# EAGLE design bioshield (EAGLE 7.5.0)

## Sheet 1 of 7: INTERFACE
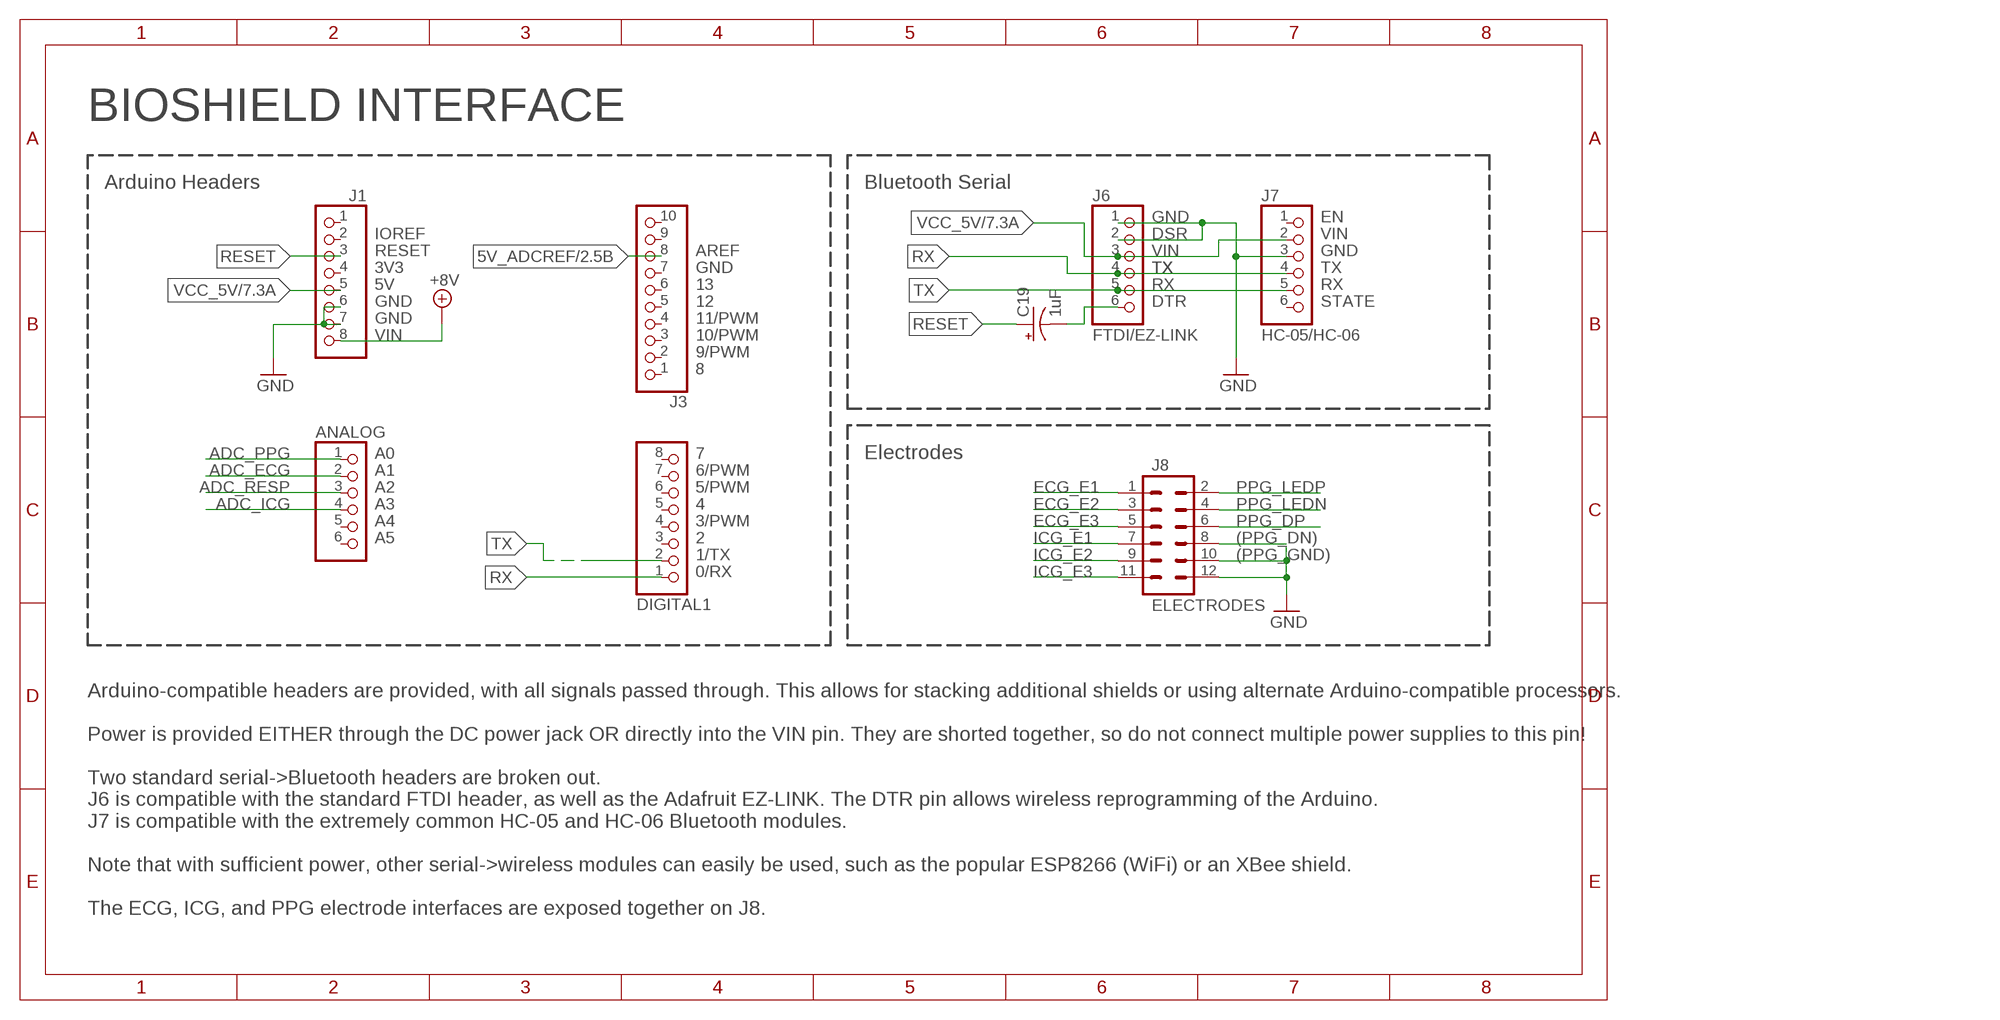
[diagram p0: schematic, sheet 1]

### Parts
ANALOG  PINHD-1X6  [1X06]
C19  1uF  CPOL-USE2-5  [E2-5]
DIGITAL1  PINHD-1X8TH  [1X08-TH]
J1  PINHD-1X8TH  [1X08-TH]
J3  PINHD-1X10TH  [1X10-TH]
J6  FTDI/EZ-LINK  PINHD-1X6  [1X06]
J7  HC-05/HC-06  PINHD-1X6  [1X06]
J8  ELECTRODES  M06X2PTH_FEMALE  [2X6]

### Nets
5V_ADCREF: J3.8 ; also sheet 2
+8V: J1.8 ; also sheet 2,3,4,5,6
ADC_ECG: ANALOG.2 ; also sheet 7
ADC_ICG: ANALOG.4 ; also sheet 7
ADC_PPG: ANALOG.1 ; also sheet 7
ADC_RESP: ANALOG.3 ; also sheet 7
ECG_E1: J8.1 ; also sheet 3
ECG_E2: J8.3 ; also sheet 3
ECG_E3: J8.5 ; also sheet 3
GND: J1.6 J1.7 J6.1 J6.2 J7.3 J8.8 J8.10 J8.12 ; also sheet 2,3,4,5,6,7
ICG_E1: J8.7 ; also sheet 4
ICG_E2: J8.9 ; also sheet 4
ICG_E3: J8.11 ; also sheet 4
N$6: C19.- J6.6
PPG_DP: J8.6 ; also sheet 6
PPG_LEDN: J8.4 ; also sheet 6
PPG_LEDP: J8.2 ; also sheet 6
RESET: C19.+ J1.3
RX: DIGITAL1.1 J6.4 J7.4
TX: DIGITAL1.2 J6.5 J7.5
VCC_5V: J1.5 J6.3 J7.2 ; also sheet 7
Unconnected: ANALOG.5 ANALOG.6 DIGITAL1.3 DIGITAL1.4 DIGITAL1.5 DIGITAL1.6 DIGITAL1.7 DIGITAL1.8 J1.1 J1.2 J1.4 J3.1 J3.2 J3.3 J3.4 J3.5 J3.6 J3.7 J3.9 J3.10 J7.1 J7.6

### Notes on the sheet
- BIOSHIELD INTERFACE
- Arduino Headers | Bluetooth Serial
- GND | EN
- IOREF | DSR | VIN
- RESET | AREF | VIN | GND
- 3V3 | GND | TX | TX | TX
- 5V | 13 | RX | RX
- GND | 12 | DTR | STATE
- GND | 11/PWM
- VIN | 10/PWM
- 9/PWM
- 8
- A0 | 7 | Electrodes
- A1 | 6/PWM
- A2 | 5/PWM
- A3 | 4
- A4 | 3/PWM
- A5 | 2 | (PPG_DN)
- 1/TX | (PPG_GND)
- 0/RX
- Arduino-compatible headers are provided, with all signals passed through. This allows for stacking additional shields or using alternate Arduino-compatible processors.
  
  Power is provided EITHER through the DC power jack OR directly into the VIN pin. They are shorted together, so do not connect multiple power supplies to this pin\!
  
  Two standard serial->Bluetooth headers are broken out. 
  J6 is compatible with the standard FTDI header, as well as the Adafruit EZ-LINK. The DTR pin allows wireless reprogramming of the Arduino.
  J7 is compatible with the extremely common HC-05 and HC-06 Bluetooth modules.
  
  Note that with sufficient power, other serial->wireless modules can easily be used, such as the popular ESP8266 (WiFi) or an XBee shield.
  
  The ECG, ICG, and PPG electrode interfaces are exposed together on J8.

## Sheet 2 of 7: POWER
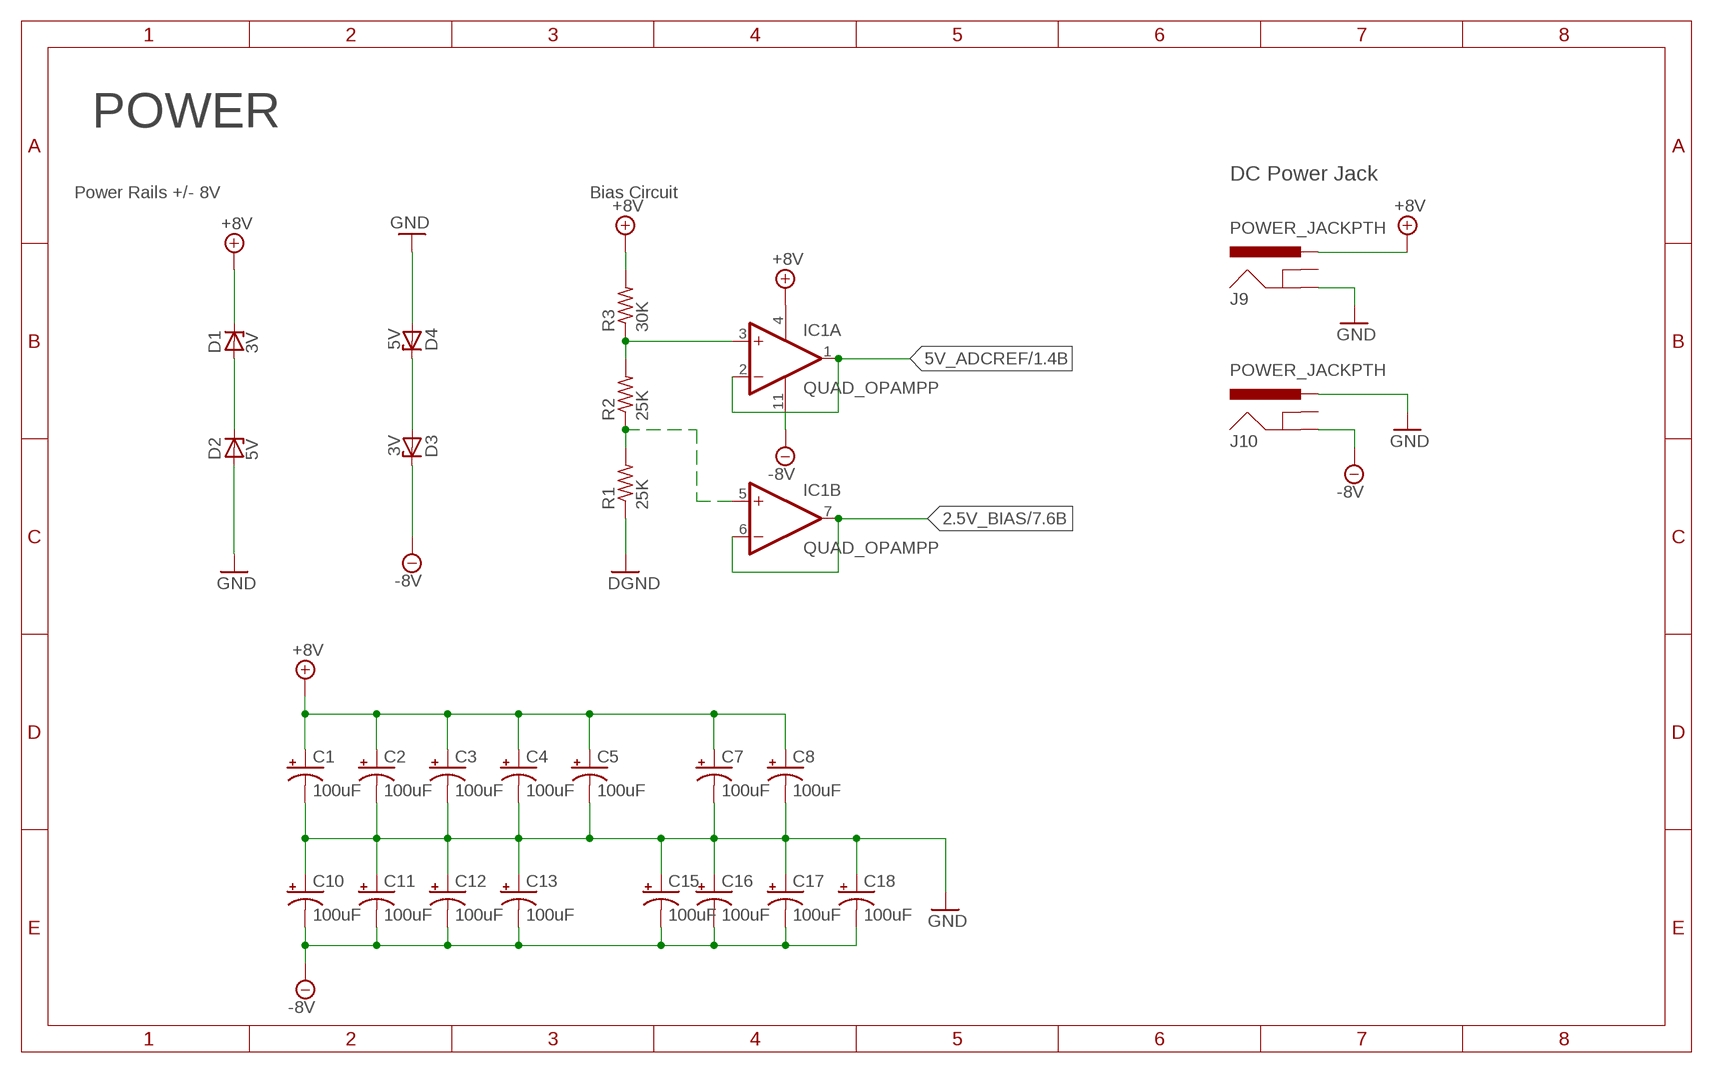
[diagram p1: schematic, sheet 2]

### Parts
C1  100uF  CAP_POLPTH1  [CPOL-RADIAL-100UF-25V]
C2  100uF  CAP_POLPTH1  [CPOL-RADIAL-100UF-25V]
C3  100uF  CAP_POLPTH1  [CPOL-RADIAL-100UF-25V]
C4  100uF  CAP_POLPTH1  [CPOL-RADIAL-100UF-25V]
C5  100uF  CAP_POLPTH1  [CPOL-RADIAL-100UF-25V]
C7  100uF  CAP_POLPTH1  [CPOL-RADIAL-100UF-25V]
C8  100uF  CAP_POLPTH1  [CPOL-RADIAL-100UF-25V]
C10  100uF  CAP_POLPTH1  [CPOL-RADIAL-100UF-25V]
C11  100uF  CAP_POLPTH1  [CPOL-RADIAL-100UF-25V]
C12  100uF  CAP_POLPTH1  [CPOL-RADIAL-100UF-25V]
C13  100uF  CAP_POLPTH1  [CPOL-RADIAL-100UF-25V]
C15  100uF  CAP_POLPTH1  [CPOL-RADIAL-100UF-25V]
C16  100uF  CAP_POLPTH1  [CPOL-RADIAL-100UF-25V]
C17  100uF  CAP_POLPTH1  [CPOL-RADIAL-100UF-25V]
C18  100uF  CAP_POLPTH1  [CPOL-RADIAL-100UF-25V]
D1  3V  ZENER-DIODEZD-10  [ZDIO-10]
D2  5V  ZENER-DIODEZD-10  [ZDIO-10]
D3  3V  ZENER-DIODEZD-10  [ZDIO-10]
D4  5V  ZENER-DIODEZD-10  [ZDIO-10]
IC1  QUAD_OPAMPP  [DIL14]
J9  POWER_JACKPTH  [POWER_JACK_PTH]
J10  POWER_JACKPTH  [POWER_JACK_PTH]
R1  25K  R-US_0207/10  [0207/10]
R2  25K  R-US_0207/10  [0207/10]
R3  30K  R-US_0207/10  [0207/10]

### Nets
2.5V_BIAS: IC1.6(B:-IN) IC1.7(B:OUT) ; also sheet 7
5V_ADCREF: IC1.1(A:OUT) IC1.2(A:-IN) ; also sheet 1
+8V: C1.1(+) C2.1(+) C3.1(+) C4.1(+) C5.1(+) C7.1(+) C8.1(+) D1.C IC1.4(P:V+) J9.PWR R3.2 ; also sheet 1,3,4,5,6
-8V: C10.2(-) C11.2(-) C12.2(-) C13.2(-) C15.2(-) C16.2(-) C17.2(-) C18.2(-) D3.C IC1.11(P:V-) J10.GND ; also sheet 3,4,5,6
GND: C1.2(-) C2.2(-) C3.2(-) C4.2(-) C5.2(-) C7.2(-) C8.2(-) C10.1(+) C11.1(+) C12.1(+) C13.1(+) C15.1(+) C16.1(+) C17.1(+) C18.1(+) D2.A D4.A J9.GND J10.PWR R1.1 ; supply symbol labelled DGND ; also sheet 1,3,4,5,6,7
N$3: IC1.5(B:+IN) R1.2 R2.1
N$10: D1.A D2.C
N$28: IC1.3(A:+IN) R2.2 R3.1
N$33: D3.A D4.C
Unconnected: J9.GNDBREAK J10.GNDBREAK

### Notes on the sheet
- POWER
- DC Power Jack
- Power Rails +/- 8V | Bias Circuit

## Sheet 3 of 7: ECG
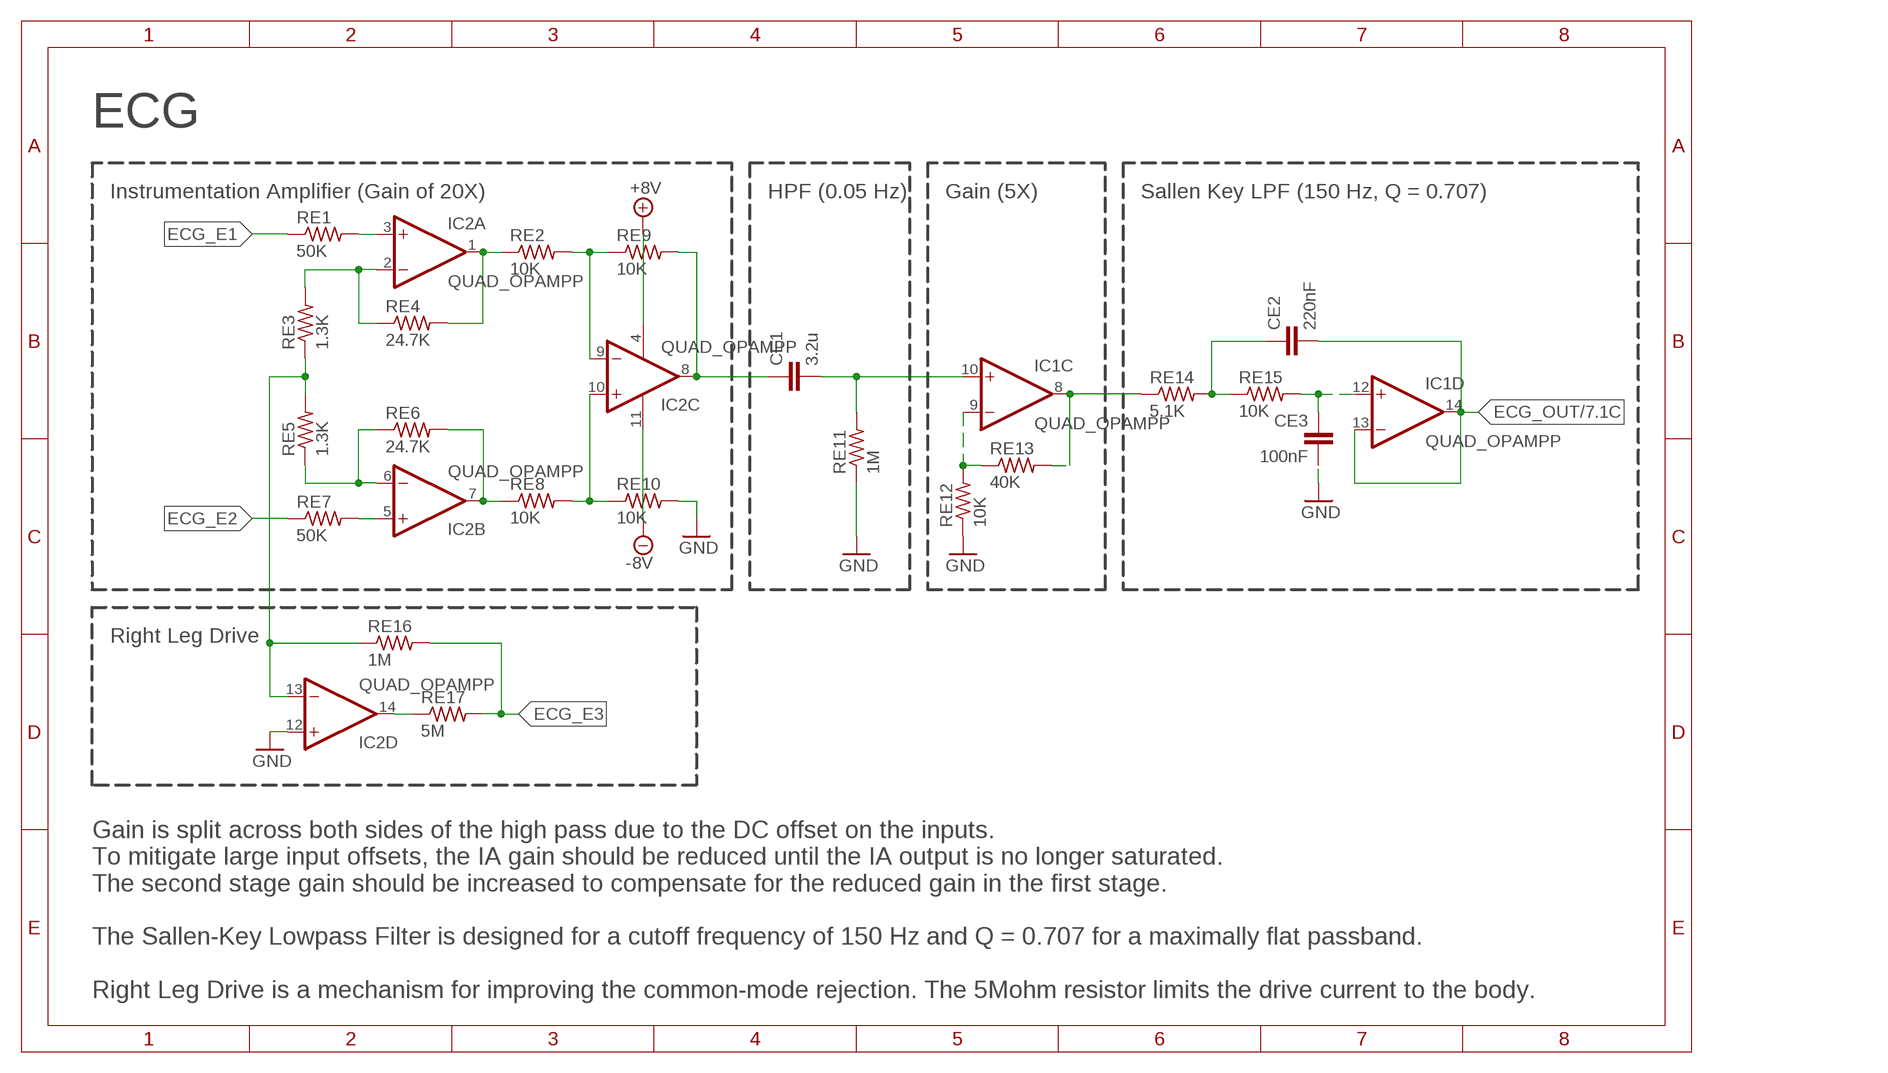
[diagram p2: schematic, sheet 3]

### Parts
CE1  3.2u  CAPPTH1  [CAP-PTH-5MM]
CE2  220nF  CAPPTH1  [CAP-PTH-5MM]
CE3  100nF  CAPPTH1  [CAP-PTH-5MM]
IC2  QUAD_OPAMPP  [DIL14]
RE1  50K  R-US_0207/10  [0207/10]
RE2  10K  R-US_0207/10  [0207/10]
RE3  1.3K  R-US_0207/10  [0207/10]
RE4  24.7K  R-US_0207/10  [0207/10]
RE5  1.3K  R-US_0207/10  [0207/10]
RE6  24.7K  R-US_0207/10  [0207/10]
RE7  50K  R-US_0207/10  [0207/10]
RE8  10K  R-US_0207/10  [0207/10]
RE9  10K  R-US_0207/10  [0207/10]
RE10  10K  R-US_0207/10  [0207/10]
RE11  1M  R-US_0207/10  [0207/10]
RE12  10K  R-US_0207/10  [0207/10]
RE13  40K  R-US_0207/10  [0207/10]
RE14  5.1K  R-US_0207/10  [0207/10]
RE15  10K  R-US_0207/10  [0207/10]
RE16  1M  R-US_0207/10  [0207/10]
RE17  5M  R-US_0207/10  [0207/10]

### Nets
+8V: IC2.4(P:V+) ; also sheet 1,2,4,5,6
-8V: IC2.11(P:V-) ; also sheet 2,4,5,6
ECG_E1: RE1.1 ; also sheet 1
ECG_E2: RE7.1 ; also sheet 1
ECG_E3: RE16.2 RE17.2 ; also sheet 1
ECG_OUT: CE2.2 IC1.13(D:-IN) IC1.14(D:OUT) ; also sheet 7
GND: CE3.2 IC2.12(D:+IN) RE10.2 RE11.1 RE12.1 ; also sheet 1,2,4,5,6,7
N$2: IC1.9(C:-IN) RE12.2 RE13.1
N$11: CE1.2 IC1.10(C:+IN) RE11.2
N$12: CE3.1 IC1.12(D:+IN) RE15.2
N$13: IC1.8(C:OUT) RE13.2 RE14.1
N$14: CE2.1 RE14.2 RE15.1
N$15: IC2.14(D:OUT) RE17.1
N$16: IC2.5(B:+IN) RE7.2
N$26: IC2.13(D:-IN) RE3.1 RE5.2 RE16.1
N$47: IC2.6(B:-IN) RE5.1 RE6.1
N$69: IC2.7(B:OUT) RE6.2 RE8.1
N$70: IC2.10(C:+IN) RE8.2 RE10.1
N$71: IC2.2(A:-IN) RE3.2 RE4.1
N$72: IC2.1(A:OUT) RE2.1 RE4.2
N$73: IC2.3(A:+IN) RE1.2
N$75: IC2.9(C:-IN) RE2.2 RE9.1
N$77: CE1.1 IC2.8(C:OUT) RE9.2

### Notes on the sheet
- ECG
- Instrumentation Amplifier (Gain of 20X) | HPF (0.05 Hz) | Gain (5X) | Sallen Key LPF (150 Hz, Q = 0.707)
- Right Leg Drive
- Gain is split across both sides of the high pass due to the DC offset on the inputs.
  To mitigate large input offsets, the IA gain should be reduced until the IA output is no longer saturated. 
  The second stage gain should be increased to compensate for the reduced gain in the first stage.
  
  The Sallen-Key Lowpass Filter is designed for a cutoff frequency of 150 Hz and Q = 0.707 for a maximally flat passband.
  
  Right Leg Drive is a mechanism for improving the common-mode rejection. The 5Mohm resistor limits the drive current to the body.

## Sheet 4 of 7: ICG
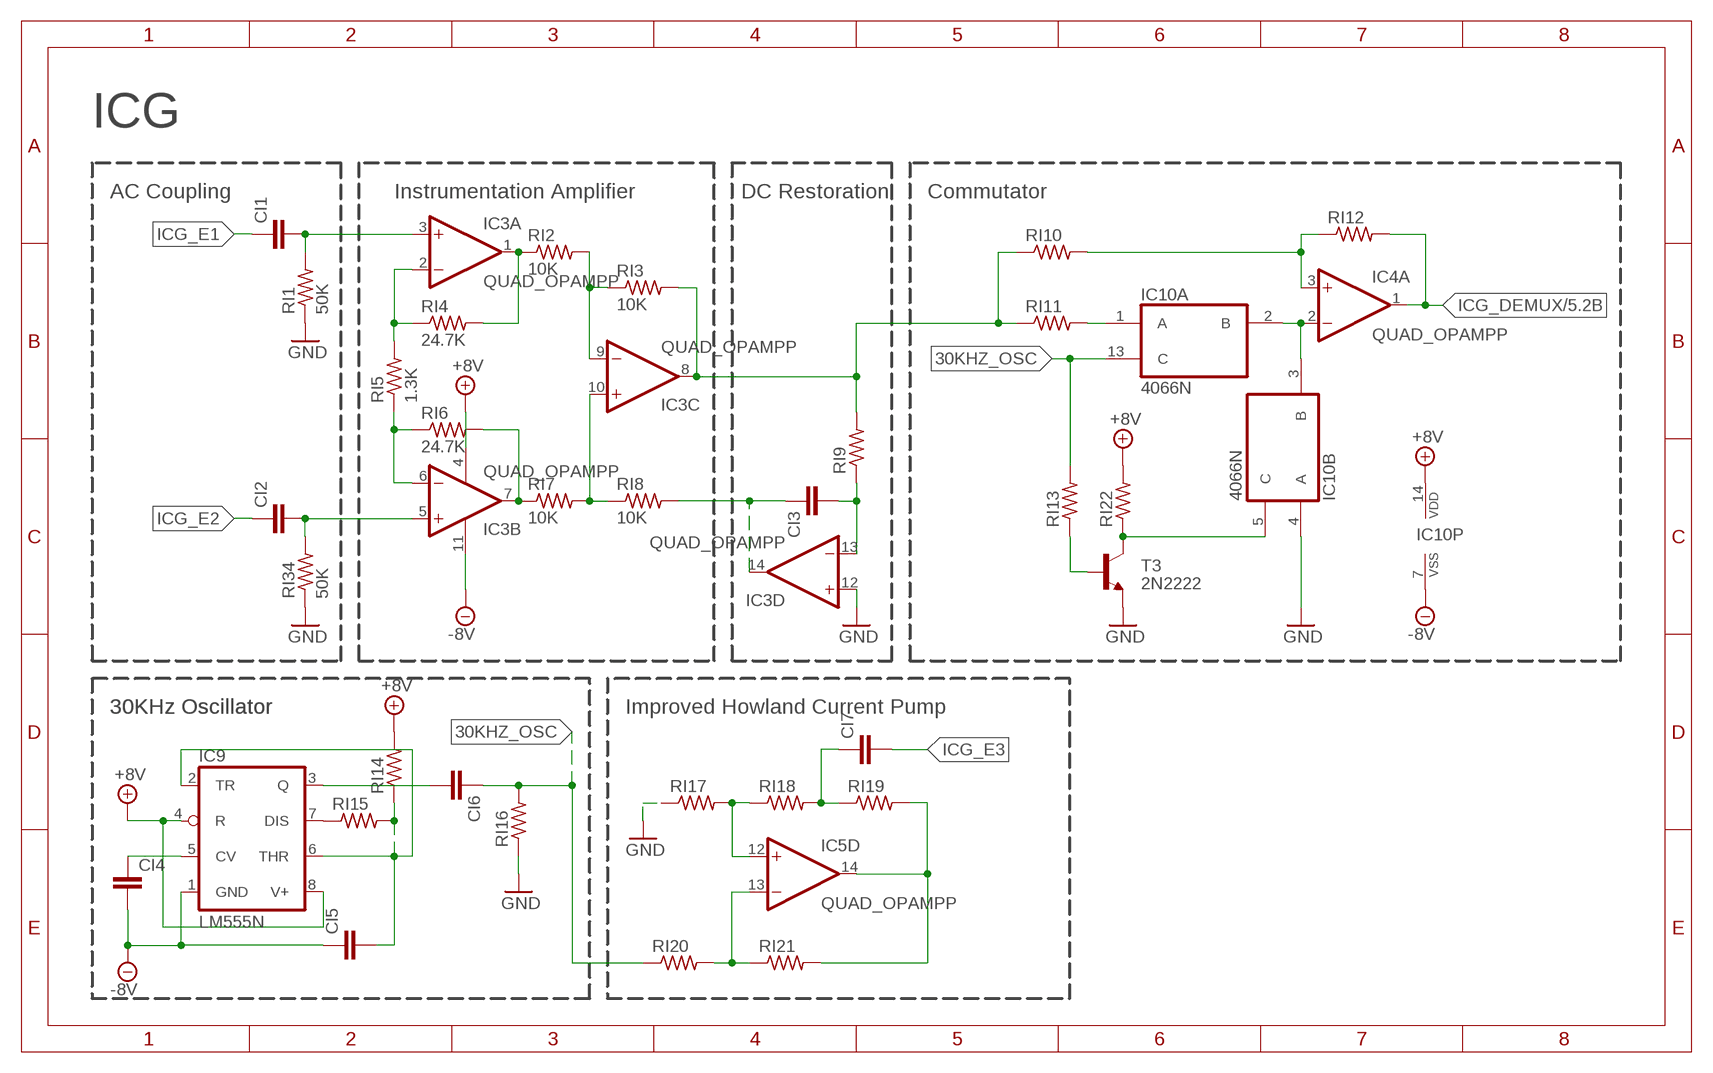
[diagram p3: schematic, sheet 4]

### Parts
CI1  CAPPTH1  [CAP-PTH-5MM]
CI2  CAPPTH1  [CAP-PTH-5MM]
CI3  CAPPTH1  [CAP-PTH-5MM]
CI4  CAPPTH1  [CAP-PTH-5MM]
CI5  CAPPTH1  [CAP-PTH-5MM]
CI6  CAPPTH1  [CAP-PTH-5MM]
CI7  CAPPTH1  [CAP-PTH-5MM]
IC3  QUAD_OPAMPP  [DIL14]
IC4  QUAD_OPAMPP  [DIL14]
IC5  QUAD_OPAMPP  [DIL14]
IC9  LM555N  [DIL08]
IC10  4066N  [DIL14]
RI1  50K  R-US_0207/10  [0207/10]
RI2  10K  R-US_0207/10  [0207/10]
RI3  10K  R-US_0207/10  [0207/10]
RI4  24.7K  R-US_0207/10  [0207/10]
RI5  1.3K  R-US_0207/10  [0207/10]
RI6  24.7K  R-US_0207/10  [0207/10]
RI7  10K  R-US_0207/10  [0207/10]
RI8  10K  R-US_0207/10  [0207/10]
RI9  R-US_0207/10  [0207/10]
RI10  R-US_0207/10  [0207/10]
RI11  R-US_0207/10  [0207/10]
RI12  R-US_0207/10  [0207/10]
RI13  R-US_0207/10  [0207/10]
RI14  R-US_0207/10  [0207/10]
RI15  R-US_0207/10  [0207/10]
RI16  R-US_0207/10  [0207/10]
RI17  R-US_0207/10  [0207/10]
RI18  R-US_0207/10  [0207/10]
RI19  R-US_0207/10  [0207/10]
RI20  R-US_0207/10  [0207/10]
RI21  R-US_0207/10  [0207/10]
RI22  R-US_0207/10  [0207/10]
RI34  50K  R-US_0207/10  [0207/10]
T3  2N2222  [TO92-EBC-OVAL]

### Nets
30KHZ_OSC: CI6.1 IC10.13(A:C) RI13.2 RI16.2 RI20.1
+8V: IC3.4(P:V+) IC9.4(R) IC9.8(V+) IC10.14(P:VDD) RI14.2 RI22.2 ; also sheet 1,2,3,5,6
-8V: CI4.2 CI5.1 IC3.11(P:V-) IC9.1(GND) IC10.7(P:VSS) ; also sheet 2,3,5,6
ELECTRODE3: CI7.1 RI18.2 RI19.1
GND: IC3.12(D:+IN) IC10.4(B:A) RI1.1 RI16.1 RI17.1 RI34.1 T3.E ; also sheet 1,2,3,5,6,7
ICG_DEMUX: IC4.1(A:OUT) RI12.2 ; also sheet 5
ICG_E1: CI1.1 ; also sheet 1
ICG_E2: CI2.1 ; also sheet 1
ICG_E3: CI7.2 ; also sheet 1
N$23: CI2.2 IC3.5(B:+IN) RI34.2
N$24: CI3.1 IC3.14(D:OUT) RI8.2
N$25: IC3.6(B:-IN) RI5.1 RI6.1
N$27: IC3.7(B:OUT) RI6.2 RI7.1
N$32: CI5.2 IC9.2(TR) IC9.6(THR) RI14.1 RI15.2
N$35: IC10.1(A:A) RI11.2
N$36: IC9.7(DIS) RI15.1
N$37: IC4.2(A:-IN) IC10.2(A:B) IC10.3(B:B)
N$51: RI13.1 T3.B
N$58: CI4.1 IC9.5(CV)
N$63: CI6.2 IC9.3(Q)
N$74: IC3.10(C:+IN) RI7.2 RI8.1
N$76: IC3.2(A:-IN) RI4.1 RI5.2
N$78: IC3.1(A:OUT) RI2.1 RI4.2
N$79: CI1.2 IC3.3(A:+IN) RI1.2
N$80: IC3.9(C:-IN) RI2.2 RI3.1
N$84: IC3.8(C:OUT) RI3.2 RI9.2 RI10.1 RI11.1
N$95: IC5.13(D:-IN) RI20.2 RI21.1
N$100: IC5.12(D:+IN) RI17.2 RI18.1
N$101: CI3.2 IC3.13(D:-IN) RI9.1
N$102: IC4.3(A:+IN) RI10.2 RI12.1
RI13: IC10.5(B:C) RI22.1 T3.C
V+: IC5.14(D:OUT) RI19.2 RI21.2

### Notes on the sheet
- ICG
- AC Coupling | Instrumentation Amplifier | DC Restoration | Commutator
- 30KHz Oscillator | 30KHz Oscillator | Improved Howland Current Pump

## Sheet 5 of 7: ICG con't
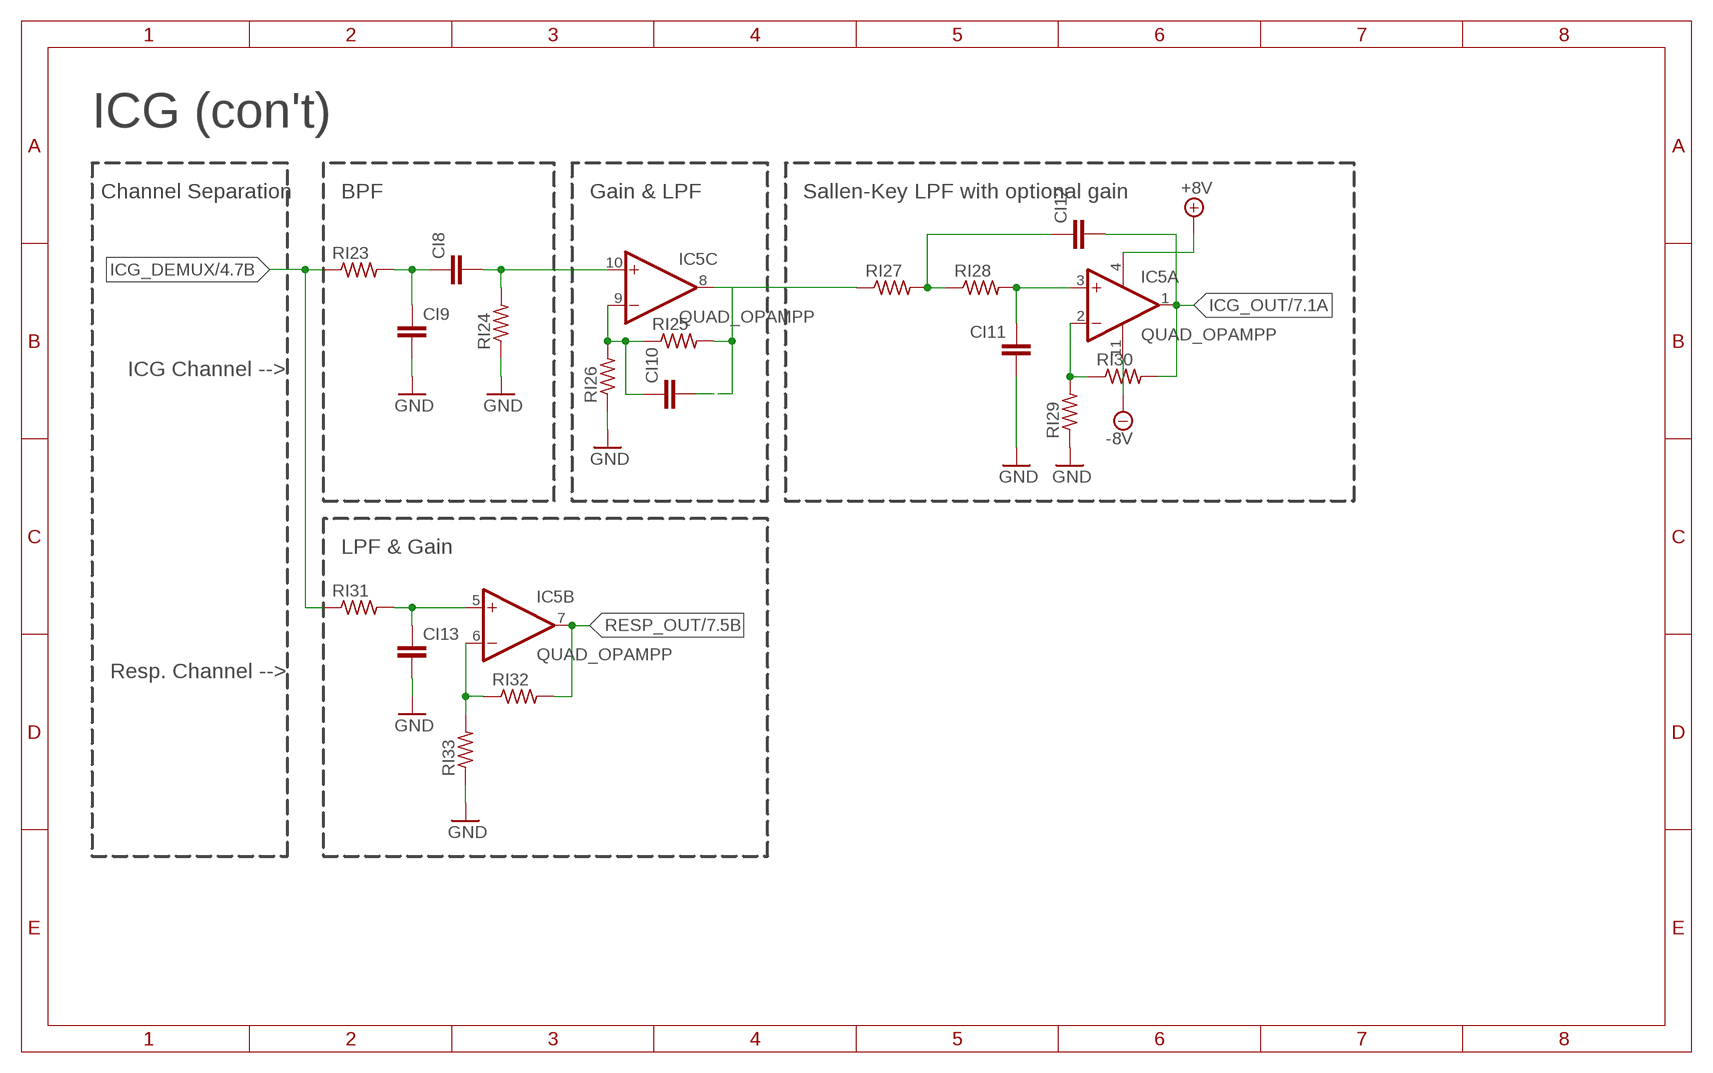
[diagram p4: schematic, sheet 5]

### Parts
CI8  CAPPTH1  [CAP-PTH-5MM]
CI9  CAPPTH1  [CAP-PTH-5MM]
CI10  CAPPTH1  [CAP-PTH-5MM]
CI11  CAPPTH1  [CAP-PTH-5MM]
CI12  CAPPTH1  [CAP-PTH-5MM]
CI13  CAPPTH1  [CAP-PTH-5MM]
RI23  R-US_0207/10  [0207/10]
RI24  R-US_0207/10  [0207/10]
RI25  R-US_0207/10  [0207/10]
RI26  R-US_0207/10  [0207/10]
RI27  R-US_0207/10  [0207/10]
RI28  R-US_0207/10  [0207/10]
RI29  R-US_0207/10  [0207/10]
RI30  R-US_0207/10  [0207/10]
RI31  R-US_0207/10  [0207/10]
RI32  R-US_0207/10  [0207/10]
RI33  R-US_0207/10  [0207/10]

### Nets
+8V: IC5.4(P:V+) ; also sheet 1,2,3,4,6
-8V: IC5.11(P:V-) ; also sheet 2,3,4,6
GND: CI9.2 CI11.2 CI13.2 RI24.1 RI26.1 RI29.1 RI33.1 ; also sheet 1,2,3,4,6,7
ICG_DEMUX: RI23.1 RI31.1 ; also sheet 4
ICG_OUT: CI12.2 IC5.1(A:OUT) RI30.2 ; also sheet 7
N$40: CI13.1 IC5.5(B:+IN) RI31.2
N$96: CI8.2 IC5.10(C:+IN) RI24.2
N$103: CI10.1 IC5.9(C:-IN) RI25.1 RI26.2
N$105: IC5.6(B:-IN) RI32.1 RI33.2
N$106: CI12.1 RI27.2 RI28.1
N$107: CI10.2 IC5.8(C:OUT) RI25.2 RI27.1
N$108: CI11.1 IC5.3(A:+IN) RI28.2
N$109: IC5.2(A:-IN) RI29.2 RI30.1
N$110: CI8.1 CI9.1 RI23.2
RESP_OUT: IC5.7(B:OUT) RI32.2 ; also sheet 7

### Notes on the sheet
- ICG (con't)
- Channel Separation | BPF | Gain & LPF | Sallen-Key LPF with optional gain
- ICG Channel -->
- LPF & Gain
- Resp. Channel -->

## Sheet 6 of 7: PPG
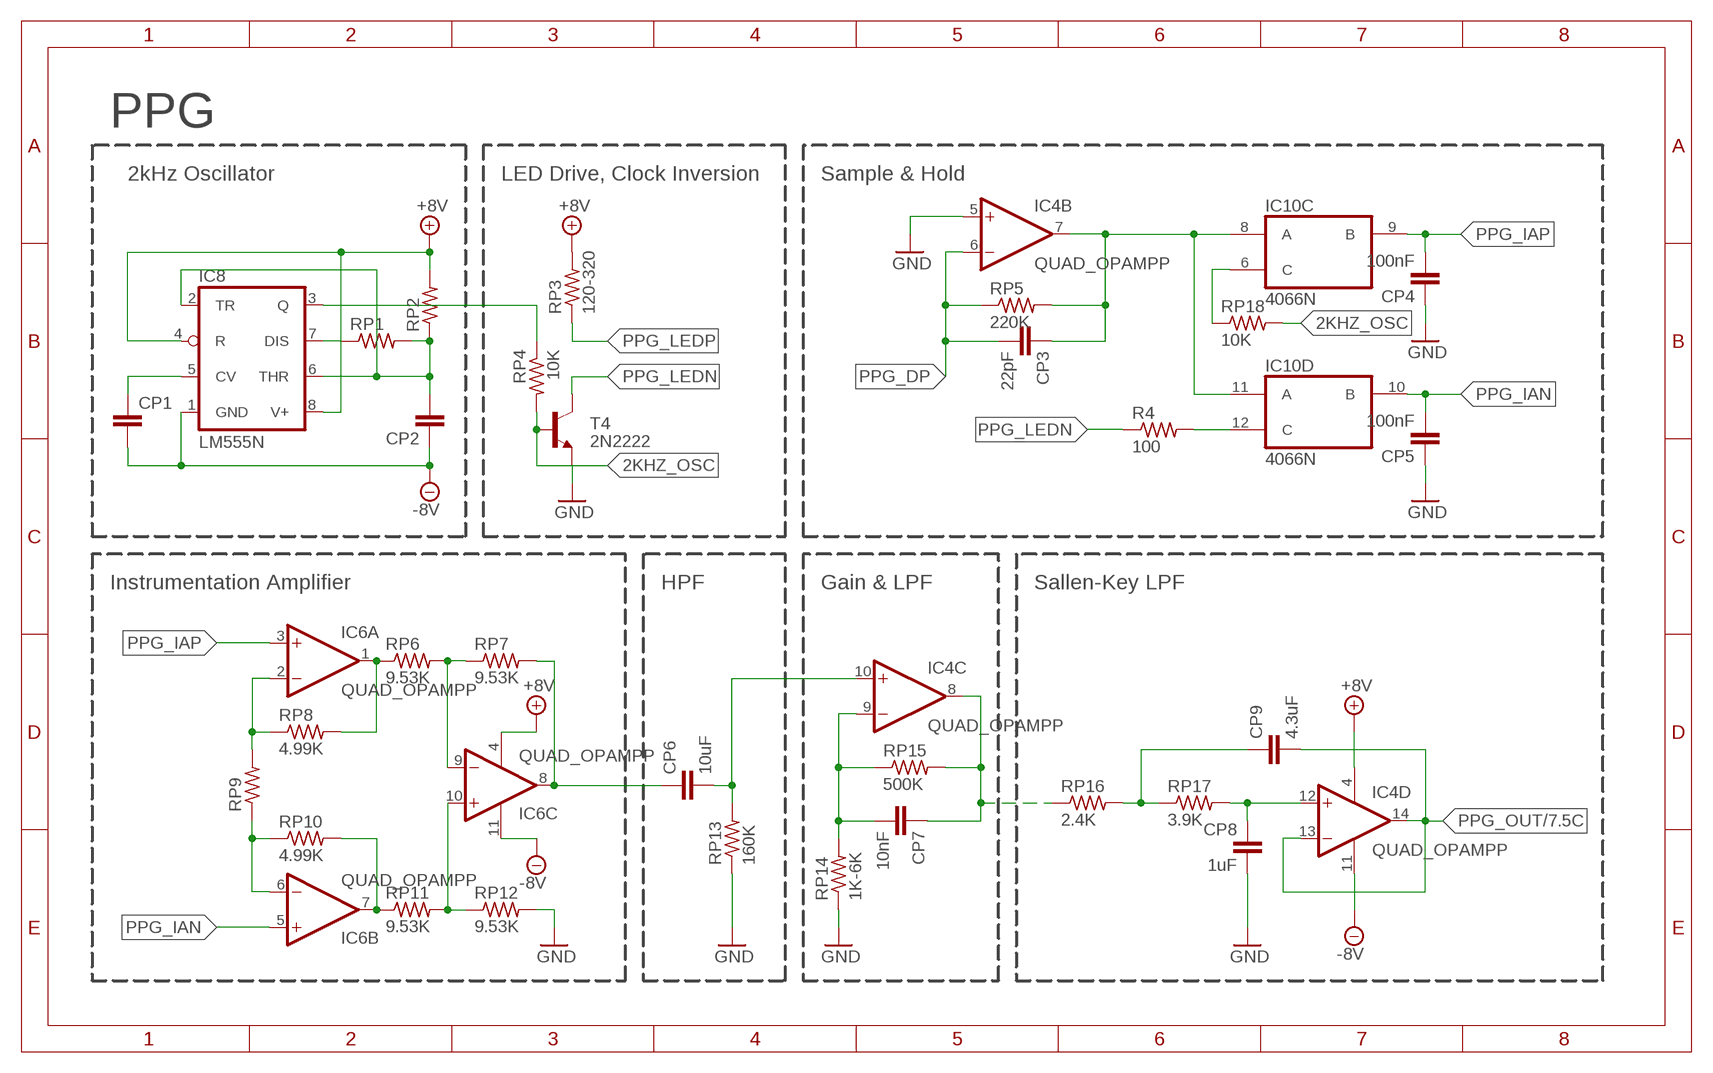
[diagram p5: schematic, sheet 6]

### Parts
CP1  CAPPTH1  [CAP-PTH-5MM]
CP2  CAPPTH1  [CAP-PTH-5MM]
CP3  22pF  CAPPTH1  [CAP-PTH-5MM]
CP4  100nF  CAPPTH1  [CAP-PTH-5MM]
CP5  100nF  CAPPTH1  [CAP-PTH-5MM]
CP6  10uF  CAPPTH1  [CAP-PTH-5MM]
CP7  10nF  CAPPTH1  [CAP-PTH-5MM]
CP8  1uF  CAPPTH1  [CAP-PTH-5MM]
CP9  4.3uF  CAPPTH1  [CAP-PTH-5MM]
IC6  QUAD_OPAMPP  [DIL14]
IC8  LM555N  [DIL08]
R4  100  R-US_0207/10  [0207/10]
RP1  R-US_0207/10  [0207/10]
RP2  R-US_0207/10  [0207/10]
RP3  120-320  R-US_0207/10  [0207/10]
RP4  10K  R-US_0207/10  [0207/10]
RP5  220K  R-US_0207/10  [0207/10]
RP6  9.53K  R-US_0207/10  [0207/10]
RP7  9.53K  R-US_0207/10  [0207/10]
RP8  4.99K  R-US_0207/10  [0207/10]
RP9  R-US_0207/10  [0207/10]
RP10  4.99K  R-US_0207/10  [0207/10]
RP11  9.53K  R-US_0207/10  [0207/10]
RP12  9.53K  R-US_0207/10  [0207/10]
RP13  160K  R-US_0207/10  [0207/10]
RP14  1K-6K  R-US_0207/10  [0207/10]
RP15  500K  R-US_0207/10  [0207/10]
RP16  2.4K  R-US_0207/10  [0207/10]
RP17  3.9K  R-US_0207/10  [0207/10]
RP18  10K  R-US_0207/10  [0207/10]
T4  2N2222  [TO92-EBC-OVAL]

### Nets
2KHZ_OSC: RP4.2 RP18.2 T4.B
+8V: IC4.4(P:V+) IC6.4(P:V+) IC8.4(R) IC8.8(V+) RP2.2 RP3.2 ; also sheet 1,2,3,4,5
-8V: CP1.2 CP2.1 IC4.11(P:V-) IC6.11(P:V-) IC8.1(GND) ; also sheet 2,3,4,5
GND: CP4.1 CP5.1 CP8.2 IC4.5(B:+IN) RP12.2 RP13.1 RP14.1 T4.E ; also sheet 1,2,3,4,5,7
N$7: IC6.6(B:-IN) RP9.1 RP10.1
N$9: IC6.7(B:OUT) RP10.2 RP11.1
N$21: IC6.10(C:+IN) RP11.2 RP12.1
N$29: IC8.7(DIS) RP1.1
N$30: CP1.1 IC8.5(CV)
N$34: IC6.2(A:-IN) RP8.1 RP9.2
N$38: IC10.6(C:C) RP18.1
N$39: IC6.1(A:OUT) RP6.1 RP8.2
N$41: CP2.2 IC8.2(TR) IC8.6(THR) RP1.2 RP2.1
N$42: IC6.9(C:-IN) RP6.2 RP7.1
N$53: CP6.1 IC6.8(C:OUT) RP7.2
N$62: CP3.1 IC4.7(B:OUT) IC10.8(C:A) IC10.11(D:A) RP5.2
N$64: CP6.2 IC4.10(C:+IN) RP13.2
N$65: IC10.12(D:C) R4.2
N$66: CP7.2 IC4.9(C:-IN) RP14.2 RP15.1
N$67: CP7.1 IC4.8(C:OUT) RP15.2 RP16.1
N$68: CP9.1 RP16.2 RP17.1
N$81: CP8.1 IC4.12(D:+IN) RP17.2
N$10000: IC8.3(Q) RP4.1
PPG_DP: CP3.2 IC4.6(B:-IN) RP5.1 ; also sheet 1
PPG_IAN: CP5.2 IC6.5(B:+IN) IC10.10(D:B)
PPG_IAP: CP4.2 IC6.3(A:+IN) IC10.9(C:B)
PPG_LEDN: R4.1 T4.C ; also sheet 1
PPG_LEDP: RP3.1 ; also sheet 1
PPG_OUT: CP9.2 IC4.13(D:-IN) IC4.14(D:OUT) ; also sheet 7
Unconnected: IC6.12(D:+IN) IC6.13(D:-IN) IC6.14(D:OUT)

### Notes on the sheet
- PPG
- 2kHz Oscillator | LED Drive, Clock Inversion | Sample & Hold
- Instrumentation Amplifier | HPF | Gain & LPF | Sallen-Key LPF

## Sheet 7 of 7: ADC INPUT
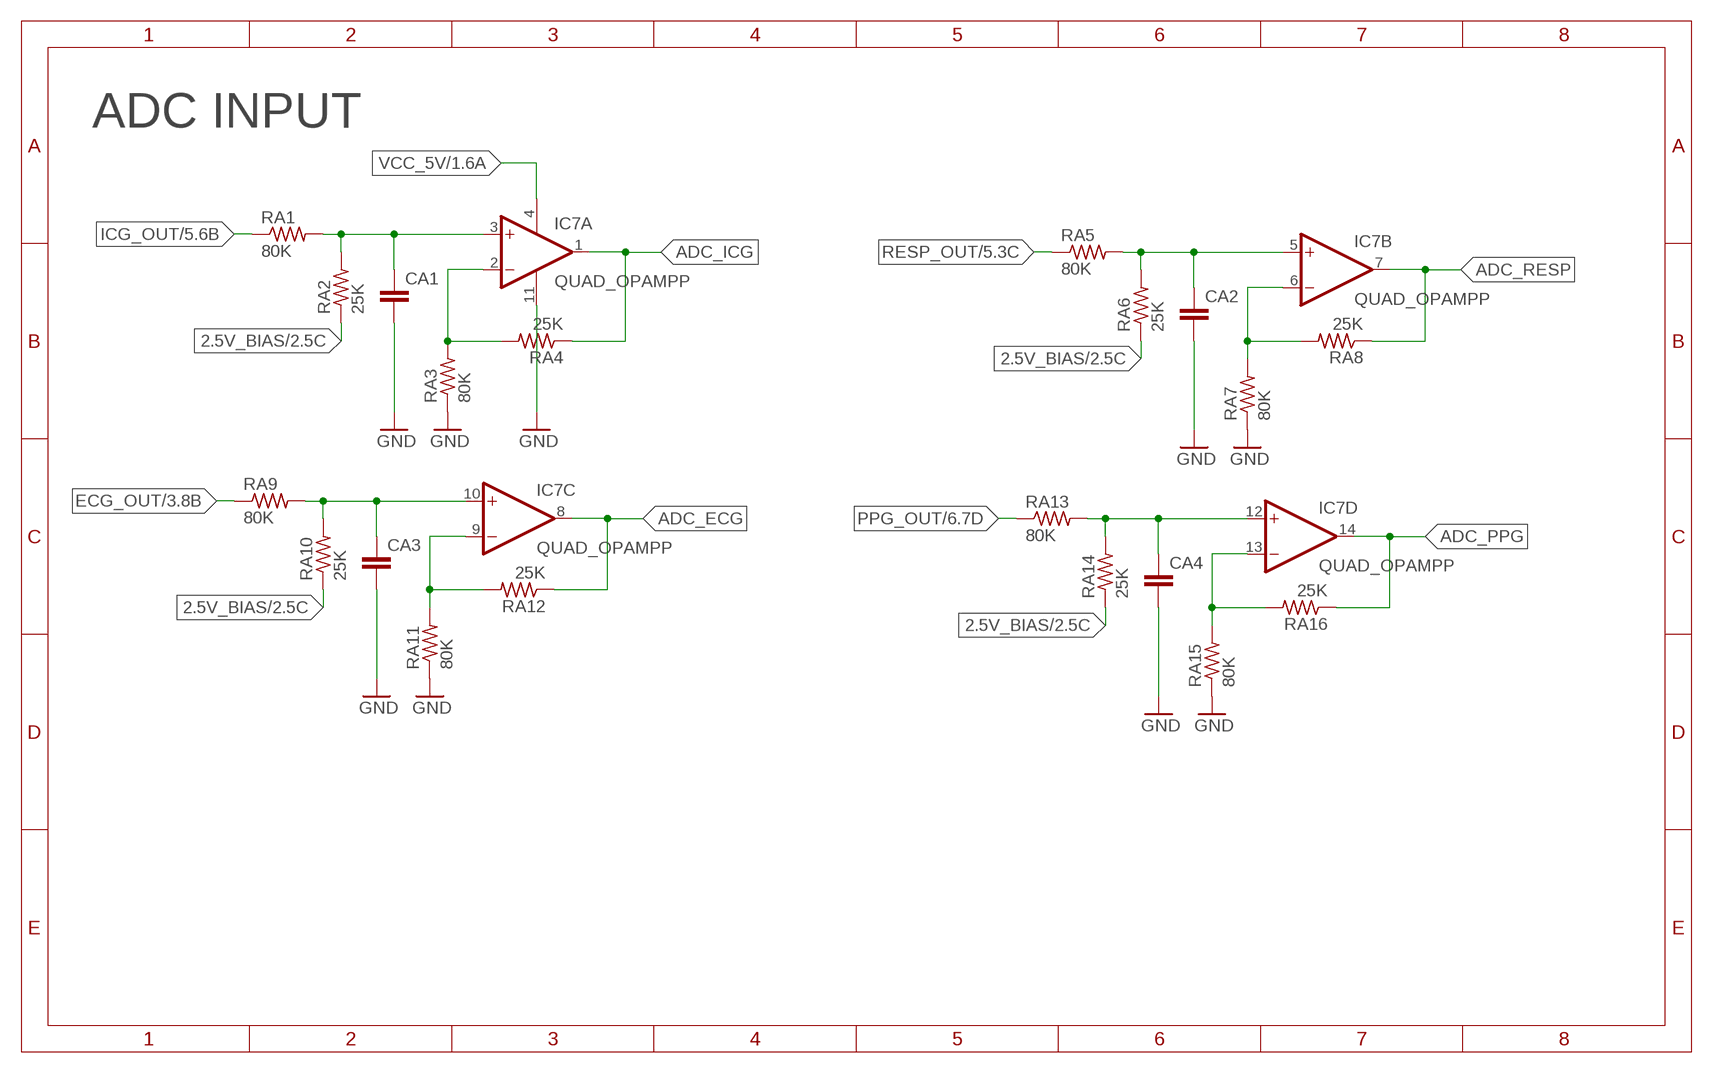
[diagram p6: schematic, sheet 7]

### Parts
CA1  CAPPTH1  [CAP-PTH-5MM]
CA2  CAPPTH1  [CAP-PTH-5MM]
CA3  CAPPTH1  [CAP-PTH-5MM]
CA4  CAPPTH1  [CAP-PTH-5MM]
IC7  QUAD_OPAMPP  [DIL14]
RA1  80K  R-US_0207/10  [0207/10]
RA2  25K  R-US_0207/10  [0207/10]
RA3  80K  R-US_0207/10  [0207/10]
RA4  25K  R-US_0207/10  [0207/10]
RA5  80K  R-US_0207/10  [0207/10]
RA6  25K  R-US_0207/10  [0207/10]
RA7  80K  R-US_0207/10  [0207/10]
RA8  25K  R-US_0207/10  [0207/10]
RA9  80K  R-US_0207/10  [0207/10]
RA10  25K  R-US_0207/10  [0207/10]
RA11  80K  R-US_0207/10  [0207/10]
RA12  25K  R-US_0207/10  [0207/10]
RA13  80K  R-US_0207/10  [0207/10]
RA14  25K  R-US_0207/10  [0207/10]
RA15  80K  R-US_0207/10  [0207/10]
RA16  25K  R-US_0207/10  [0207/10]

### Nets
2.5V_BIAS: RA2.1 RA6.1 RA10.1 RA14.1 ; also sheet 2
ADC_ECG: IC7.8(C:OUT) RA12.1 ; also sheet 1
ADC_ICG: IC7.1(A:OUT) RA4.1 ; also sheet 1
ADC_PPG: IC7.14(D:OUT) RA16.1 ; also sheet 1
ADC_RESP: IC7.7(B:OUT) RA8.1 ; also sheet 1
ECG_OUT: RA9.1 ; also sheet 3
GND: CA1.2 CA2.2 CA3.2 CA4.2 IC7.11(P:V-) RA3.1 RA7.1 RA11.1 RA15.1 ; also sheet 1,2,3,4,5,6
ICG_OUT: RA1.1 ; also sheet 5
N$48: CA1.1 IC7.3(A:+IN) RA1.2 RA2.2
N$54: IC7.2(A:-IN) RA3.2 RA4.2
N$55: CA2.1 IC7.5(B:+IN) RA5.2 RA6.2
N$56: IC7.6(B:-IN) RA7.2 RA8.2
N$57: CA3.1 IC7.10(C:+IN) RA9.2 RA10.2
N$59: IC7.9(C:-IN) RA11.2 RA12.2
N$60: CA4.1 IC7.12(D:+IN) RA13.2 RA14.2
N$61: IC7.13(D:-IN) RA15.2 RA16.2
PPG_OUT: RA13.1 ; also sheet 6
RESP_OUT: RA5.1 ; also sheet 5
VCC_5V: IC7.4(P:V+) ; also sheet 1

### Notes on the sheet
- ADC INPUT

## Library data of the parts
ANALOG J6 J7 = pinhead:PINHD-1X6: PIN HEADER
C1-C5 C7 C8 C10-C13 C15-C18 = SparkFun-Passives:CAP_POL: Capacitor Polarized These are standard SMD and PTH capacitors. Normally 10uF, 47uF, and 100uF in electrolytic and tantalum varieties. Always verify the external diameter of the through hole cap, it varies with capacity, voltage, and manufacturer. The EIA devices should be standard.
C19 = adafruit:CPOL-US: POLARIZED CAPACITOR, American symbol
CA1-CA4 CI1-CI13 CP1 CP2 = SparkFun-Capacitors:CAP: Capacitor Standard 0603 ceramic capacitor, and 0.1" leaded capacitor.
CE1-CE3 CP3-CP9 = SparkFun-Passives:CAP: Capacitor Standard 0603 ceramic capacitor, and 0.1" leaded capacitor.
D1-D4 = diode:ZENER-DIODE: Z-Diode
DIGITAL1 J1 = SmartPrj:PINHD-1X8: PIN HEADER
IC1-IC7 = adafruit:QUAD_OPAMP: OP AMP Standard quad package
IC8 IC9 = linear:*555: TIMER
IC10 = 40xx:4066: Quad bilateral ANALOG SWITCH
J3 = SmartPrj:PINHD-1X10: PIN HEADER
J8 = SparkFun-Connectors:M06X2; PROD_ID: CONN-12423; VALUE: 2X6 FEMALE
J9 J10 = SparkFun-Connectors:POWER_JACK: Power Jack This is the standard 5.5mm barrel jack for power. The PTH is the most common, proven, reliable, footprint. The Slot footprint only works if the mill layer is transmitted to the PCB fab house so be warned. Mating wall wart : TOL-00298 (and others); PROD_ID: CONN-08197
R1-R4 RA1-RA16 RE1-RE17 RI1-RI34 RP1-RP18 = resistor:R-US_: RESISTOR, American symbol
T3 T4 = adafruit:2N2222: NPN TRANSISTOR Big oval pads

## Net classes
0 default: width 0.203 mm

## Board
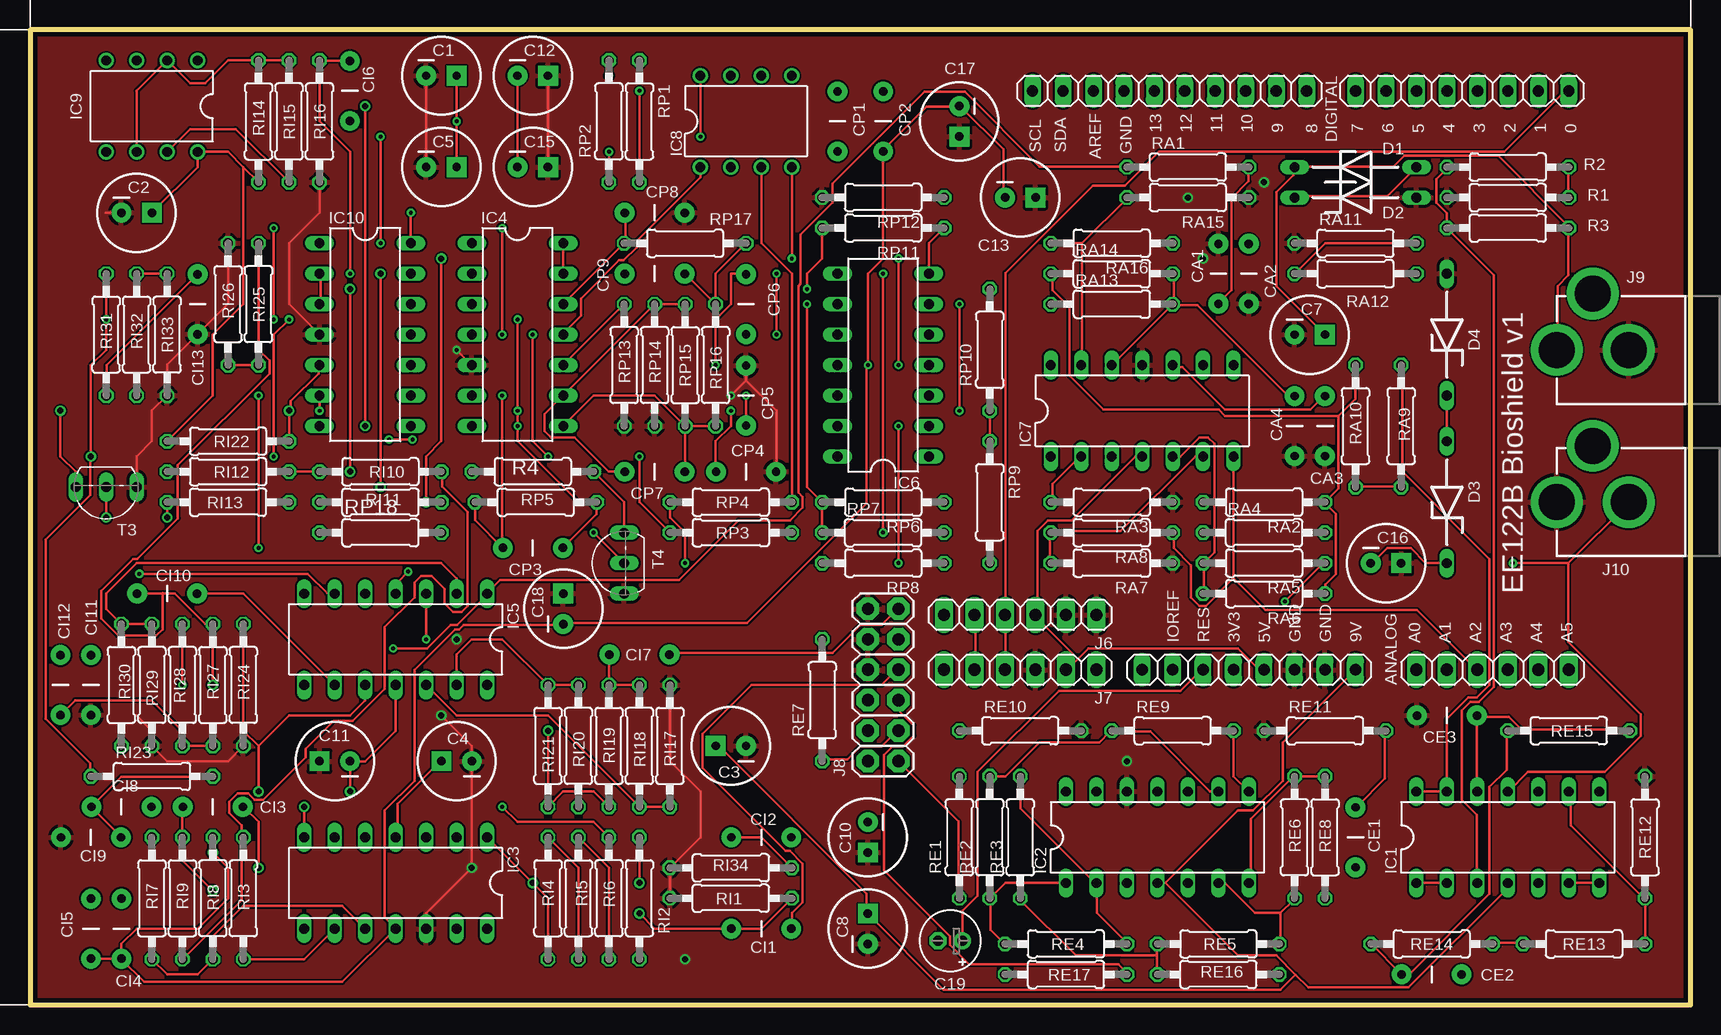
[diagram p7: board, top side]
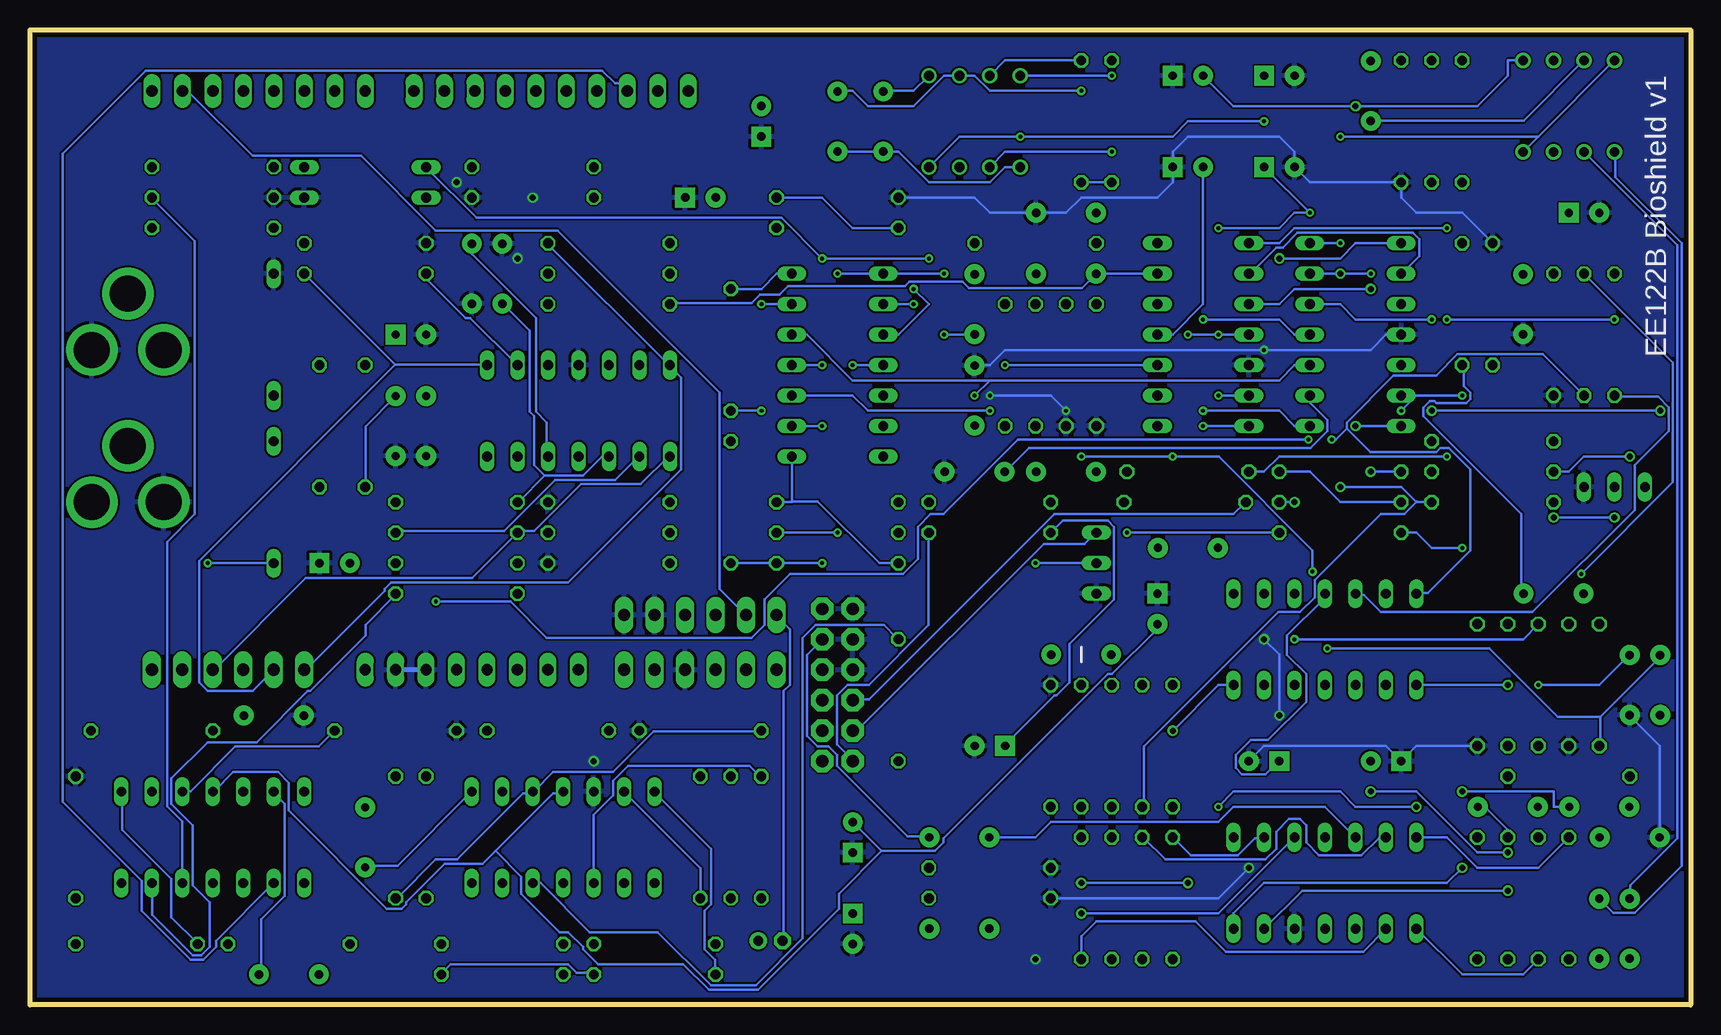
[diagram p8: board, bottom side, seen from below]

Size 138.43 x 81.28 mm. Coordinates in mm from the lower left corner, seen from the top.
Outline: 0,81.28 0,0 138.43,0 138.43,81.28 0,81.28
Copper layers (1*16): Top 0.0356mm / dielectric 1.5011mm / Bottom 0.0356mm
Design rules "oshpark-2layer": minimum track width 6mil, minimum drill 13mil, track to track 6mil, track to pad 6mil, pad to pad 6mil, via to via 6mil, smd to smd 6mil, copper to edge 15mil, drill to drill 6mil, minimum pad ring 7mil, minimum via ring 7mil, stop-mask expansion 2.5mil, vias tented up to drill 0mil, thermal gap 10mil

### Footprints (pad centres in the part's own frame; a part is rotated, then mirrored left to right if it is on the bottom)
1X06 = drill 1.016 long: 1 -6.35,0; 2 -3.81,0; 3 -1.27,0; 4 1.27,0; 5 3.81,0; 6 6.35,0
CPOL-RADIAL-100UF-25V = drill 0.7 pad 1.651 square: 1 1.27,0 | drill 0.7 pad 1.651: 2 -1.27,0
E2-5 = drill 0.813 pad 1.422: + -1.016,0 | drill 0.813 pad 1.422 octagon: - 1.016,0
CAP-PTH-5MM = drill 0.7 pad 1.651: 1 -2.5,0; 2 2.5,0
ZDIO-10 = drill 0.813 long: A 5.08,0; C -5.08,0
1X08-TH = drill 0.95 pad 1.422 long: 1 -8.89,0; 2 -6.35,0; 3 -3.81,0; 4 -1.27,0; 5 1.27,0; 6 3.81,0; 7 6.35,0; 8 8.89,0
DIL14 = drill 0.813 long: 1 -7.62,-3.81; 2 -5.08,-3.81; 3 -2.54,-3.81; 4 0,-3.81; 5 2.54,-3.81; 6 5.08,-3.81; 7 7.62,-3.81; 8 7.62,3.81; 9 5.08,3.81; 10 2.54,3.81; 11 0,3.81; 12 -2.54,3.81; 13 -5.08,3.81; 14 -7.62,3.81
DIL08 = drill 0.813 pad 1.27: 1 -3.81,-3.81; 2 -1.27,-3.81; 3 1.27,-3.81; 4 3.81,-3.81; 5 3.81,3.81; 6 1.27,3.81; 7 -1.27,3.81; 8 -3.81,3.81
1X10-TH = drill 0.95 pad 1.422 long: 1 -11.43,0; 2 -8.89,0; 3 -6.35,0; 4 -3.81,0; 5 -1.27,0; 6 1.27,0; 7 3.81,0; 8 6.35,0; 9 8.89,0; 10 11.43,0
2X6 = drill 1.016 pad 1.88 octagon: 1 0,0; 2 0,2.54; 3 2.54,0; 4 2.54,2.54; 5 5.08,0; 6 5.08,2.54; 7 7.62,0; 8 7.62,2.54; 9 10.16,0; 10 10.16,2.54; 11 12.7,0; 12 12.7,2.54
POWER_JACK_PTH = drill 2.997 pad 4.318: GND 0,7.7; GNDBREAK 4.7,10.7; PWR 0,13.7
0207/10 = drill 0.813 octagon: 1 -5.08,0; 2 5.08,0
TO92-EBC-OVAL = drill 0.813 long: B 0,-1.27; C 2.54,-1.27; E -2.54,-1.27

### Placement (x,y rotation side)
ANALOG  121.92,27.94 0 top
C1  34.29,77.47 0 top
C2  8.89,66.04 0 top
C3  58.42,21.59 180 top
C4  35.56,20.32 180 top
C5  34.29,69.85 0 top
C7  106.68,55.88 0 top
C8  69.85,6.35 90 top
C10  69.85,13.97 270 top
C11  25.4,20.32 180 top
C12  41.91,77.47 0 top
C13  82.55,67.31 0 top
C15  41.91,69.85 0 top
C16  113.03,36.83 0 top
C17  77.47,73.66 270 top
C18  44.45,33.02 90 top
C19  76.71,5.33 180 top
CA1  99.06,60.96 90 top
CA2  101.6,60.96 270 top
CA3  107.95,48.26 270 top
CA4  105.41,48.26 270 top
CE1  110.49,13.97 90 top
CE2  116.84,2.54 0 top
CE3  118.11,24.13 180 top
CI1  60.96,6.35 180 top
CI2  60.96,13.97 180 top
CI3  15.24,16.51 180 top
CI4  7.62,6.35 270 top
CI5  5.08,6.35 90 top
CI6  26.67,76.2 270 top
CI7  50.8,29.21 180 bottom
CI8  7.62,16.51 0 top
CI9  5.08,13.97 180 top
CI10  11.43,34.29 180 top
CI11  5.08,26.67 270 top
CI12  2.54,26.67 90 top
CI13  13.97,58.42 270 top
CP1  67.31,73.66 270 top
CP2  71.12,73.66 90 top
CP3  41.91,38.1 180 top
CP4  59.69,44.45 180 top
CP5  59.69,50.8 270 top
CP6  59.69,58.42 90 top
CP7  52.07,44.45 180 top
CP8  52.07,66.04 0 top
CP9  52.07,60.96 180 top
D1  110.49,69.85 0 top
D2  110.49,67.31 0 top
D3  118.11,41.91 90 top
D4  118.11,55.88 90 top
DIGITAL1  119.38,76.2 180 top
IC1  123.19,13.97 0 top
IC2  93.98,13.97 0 top
IC3  30.48,10.16 180 top
IC4  40.64,55.88 270 top
IC5  30.48,30.48 180 top
IC6  71.12,53.34 90 top
IC7  92.71,49.53 0 top
IC8  59.69,73.66 0 top
IC9  10.16,74.93 180 top
IC10  27.94,55.88 270 top
J1  101.6,27.94 0 top
J3  95,76.2 180 top
J6  82.55,32.51 180 top
J7  82.55,27.94 180 top
J8  72.39,20.32 90 top
J9  140.97,54.61 90 top
J10  140.97,41.91 90 top
R1  123.19,67.31 0 top
R2  123.19,69.85 180 top
R3  123.19,64.77 0 top
R4  41.91,44.45 180 top
RA1  96.52,69.85 0 top
RA2  102.87,41.91 180 top
RA3  90.17,41.91 180 top
RA4  102.87,39.37 0 top
RA5  102.87,36.83 180 top
RA6  102.87,34.29 180 top
RA7  90.17,36.83 180 top
RA8  90.17,39.37 180 top
RA9  114.3,48.26 270 top
RA10  110.49,48.26 270 top
RA11  110.49,63.5 0 top
RA12  110.49,60.96 180 top
RA13  90.17,58.42 0 top
RA14  90.17,60.96 0 top
RA15  96.52,67.31 180 top
RA16  90.17,63.5 180 top
RE1  77.47,13.97 90 top
RE2  80.01,13.97 90 top
RE3  82.55,13.97 90 top
RE4  86.36,5.08 180 top
RE5  99.06,5.08 180 top
RE6  105.41,13.97 90 top
RE7  66.04,25.4 90 top
RE8  107.95,13.97 270 top
RE9  95.25,22.86 0 top
RE10  82.55,22.86 0 top
RE11  107.95,22.86 0 top
RE12  134.62,13.97 270 top
RE13  129.54,5.08 180 top
RE14  116.84,5.08 180 top
RE15  128.27,22.86 0 top
RE16  99.06,2.54 0 top
RE17  86.36,2.54 0 top
RI1  58.42,8.89 0 top
RI2  50.8,8.89 270 top
RI3  17.78,8.89 90 top
RI4  43.18,8.89 270 top
RI5  45.72,8.89 270 top
RI6  48.26,8.89 90 top
RI7  10.16,8.89 270 top
RI8  15.24,8.89 90 top
RI9  12.7,8.89 270 top
RI10  29.21,44.45 180 top
RI11  29.21,41.91 0 top
RI12  16.51,44.45 180 top
RI13  16.51,41.91 0 top
RI14  19.05,73.66 270 top
RI15  21.59,73.66 90 top
RI16  24.13,73.66 90 top
RI17  53.34,21.59 270 top
RI18  50.8,21.59 90 top
RI19  48.26,21.59 270 top
RI20  45.72,21.59 90 top
RI21  43.18,21.59 270 top
RI22  16.51,46.99 180 top
RI23  10.16,19.05 0 top
RI24  17.78,26.67 90 top
RI25  19.05,58.42 90 top
RI26  16.51,58.42 270 top
RI27  15.24,26.67 270 top
RI28  12.7,26.67 90 top
RI29  10.16,26.67 90 top
RI30  7.62,26.67 270 top
RI31  6.35,55.88 270 top
RI32  8.89,55.88 270 top
RI33  11.43,55.88 90 top
RI34  58.42,11.43 0 top
RP1  50.8,73.66 270 top
RP2  48.26,73.66 90 top
RP3  58.42,39.37 180 top
RP4  58.42,41.91 180 top
RP5  42.16,41.91 0 top
RP6  71.12,41.91 180 top
RP7  71.12,39.37 0 top
RP8  71.12,36.83 180 top
RP9  80.01,41.91 270 top
RP10  80.01,54.61 90 top
RP11  71.12,64.77 180 top
RP12  71.12,67.31 180 top
RP13  49.53,53.34 90 top
RP14  52.07,53.34 90 top
RP15  54.61,53.34 270 top
RP16  57.15,53.34 90 top
RP17  54.61,63.5 180 top
RP18  29.21,39.37 0 top
T3  6.35,41.91 180 top
T4  48.26,36.83 90 top

### Tracks (layer width: path | path; a pad name or v marks a point on that pad's centre or on a via)
2.5V_BIAS
  Top 0.203: IC1.7 IC1.6 | RA6.1 107.97,34.34 107.97,35.05 108.86,35.94 108.86,40.92 107.97,41.81 RA2.1 107.97,41.99 109.04,43.05 109.04,49.1 | 109.04,49.1 110.47,50.52 110.47,53.19 RA10.1 | 109.04,49.1 99.62,49.1 99.08,49.63 89.48,49.63 86.64,52.48 86.64,58.17 85.22,59.59 85.22,60.83 RA14.1
  Bottom 0.203: IC1.6 128.25,10.16 128.25,7.49 124.87,4.12 124.16,4.12 123.44,4.83 123.44,8.56 124.87,9.98 124.87,14.96 126.64,16.74 126.64,18.87 123.62,21.89 119.53,21.89 115.26,26.16 115.09,26.16 110.47,30.79 110.47,31.67 107.97,34.16 RA6.1
2KHZ_OSC  (via drill 0.33)
  Top 0.203: v46.99,39.37 T4.B | RP4.2 53.34,40.64 54.61,39.37 v54.61,36.83
  Bottom 0.203: RP18.2 v46.99,39.37 | T4.B v54.61,36.83
5V_ADCREF
  Top 0.203: IC1.2 IC1.1
  Bottom 0.203: IC1.2 122.91,5.36 122.91,4.83 123.98,3.76 125.04,3.76 129.13,7.85 129.13,10.34 135.71,16.92 135.71,70.97 128.78,77.9 90.73,77.9 89.66,76.83 88.77,76.83 J3.8
  Bottom 0.406: 88.58,76.83 88.58,76.26 J3.8
30KHZ_OSC  (via drill 0.33, 0.5)
  Top 0.203: CI6.1 24.17,78.7 RI16.2 24.13,73.66 26.67,71.12 v26.67,60.96 | v29.21,43.18 v29.21,60.96
  Bottom 0.203: IC10.13 v29.21,60.96 v26.67,60.96 | v29.21,43.18 24.13,43.18 22.87,41.92 | 22.87,41.92 22.86,41.91 RI13.2 | 22.87,41.92 23.88,40.92 25.83,40.92 31.34,35.41 31.34,33.98 32.59,32.74 34.37,32.74 45.57,21.54 45.57,16.56 RI20.1 | 22.81,41.99 22.87,41.92
+8V  (via drill 0.33)
  Top 0.203: 17.78,69.85 16.51,71.12 IC9.8 13.97,69.85 C2.1 | 17.78,69.85 RI14.2 | RI22.2 15.24,50.8 15.24,55.88 17.78,58.42 17.78,69.85 | v39.37,64.77 v39.37,55.88 | IC10.14 v31.75,66.04 | v29.21,72.39 v29.21,63.5 | C5.1 v35.56,73.66 C1.1 | RP2.2 v48.26,77.47 | IC8.8 v55.88,72.39 | RP3.2 50.8,41.91 v50.8,45.72 | v43.18,45.72 41.91,46.99 v41.91,55.88 | v72.39,62.23 v72.39,53.34 | IC8.4 v63.5,62.23 | 94.64,10.16 IC2.4 | 94.64,10.16 100.69,16.21 101.93,16.21 104.42,18.69 104.42,21.89 110.47,27.94 J1.8 | 105.49,2.52 103.89,4.12 100.69,4.12 94.64,10.16 | 105.49,2.52 106.55,1.45 114.91,1.45 123.09,9.63 123.09,10.16 IC1.4 | C7.1 103.89,59.94 103.89,67.77 105.31,69.19 105.31,69.72 D1.C 105.49,69.9 113.66,69.9 114.55,70.79 122.38,70.79 128.25,64.92 R3.2 128.25,64.75 128.25,60.83 127.36,59.94 127.36,54.61 J9.PWR | C3.1 57.3,21.72 69.75,9.27 69.75,7.67 C8.1 69.93,7.49 76.15,1.27 104.24,1.27 105.49,2.52 | IC3.4 30.63,14.07 30.63,16.74 34.19,20.3 C4.1 | v31.52,36.12 30.63,35.23 30.63,34.34 IC5.4
  Bottom 0.203: IC9.8 12.7,72.39 | 12.7,72.39 IC9.4 | IC4.4 v39.37,55.88 v41.91,55.88 | v39.37,64.77 34.29,64.77 33.02,66.04 v31.75,66.04 C5.1 | v29.21,63.5 IC10.14 | 12.7,72.39 v29.21,72.39 | v48.26,77.47 IC8.8 | IC8.4 60.96,72.39 v55.88,72.39 43.18,72.39 41.91,73.66 v35.56,73.66 | v50.8,45.72 v43.18,45.72 39.34,45.72 31.52,37.9 v31.52,36.12 | v72.39,53.34 IC6.4 | v63.5,62.23 v72.39,62.23 75.79,65.63 101.22,65.63 105.31,69.72 D1.C | IC5.4 30.63,34.16 30.63,33.81 33.66,30.79 33.66,29.19 32.05,27.58 32.05,25.27 35.25,22.07 36.68,22.07 37.92,20.83 37.92,19.76 37.39,19.23 35.43,19.23 34.37,20.3 C4.1 | RP3.2 52.32,40.39 48.59,40.39 48.06,39.85 48.06,33.81 51.79,30.07 51.79,26.87 52.86,25.81 53.03,25.81 57.12,21.72 C3.1
-8V  (via drill 0.33, 0.5)
  Top 0.203: CI4.2 CI5.1 | v26.67,17.78 C11.2 27.94,20.32 30.48,22.86 IC5.11 | v15.24,12.7 16.51,11.43 16.51,8.89 13.97,6.35 8.89,6.35 7.62,5.08 CI4.2 | CI4.2 7.62,3.81 9.52,1.91 26.03,1.91 IC3.11 30.45,6.43 29.57,7.32 29.57,16.21 32.05,18.69 32.05,27.94 35.43,31.32 35.79,31.32 36.14,31.67 44.32,31.67 C18.2 44.5,31.85 59.79,31.85 69.75,41.81 69.75,53.19 v69.85,53.34 69.85,60.96 71.12,62.23 CP2.1 71.17,71.32 74.73,74.88 77.39,74.88 C17.2 77.57,74.88 81.13,71.32 81.13,67.41 C13.2 | v27.94,74.93 v27.94,48.26 | C15.2 C12.2 | D3.C 116.33,36.83 115.09,38.08 113.13,38.08 111.89,36.83 C16.2 | 128.25,36.83 v123.62,36.83 | 128.25,36.83 133.22,41.81 J10.GND | 128.25,36.83 128.25,30.25 134.29,24.21 134.29,22.43 131.27,19.41 124.87,19.41 123.27,17.8 IC1.11 | IC8.1 55.88,69.01 50.55,63.68 50.55,63.14 49.48,62.08 49.12,62.08 45.92,58.88 45.92,57.45 44.5,56.03 IC4.11
  Bottom 0.203: v15.24,12.7 17.78,12.7 22.86,17.78 v26.67,17.78 | v27.94,48.26 IC10.7 | IC9.1 15.24,78.74 15.24,77.47 17.78,74.93 v27.94,74.93 38.1,74.93 C12.2 | IC4.11 43.18,55.88 40.64,58.42 C15.2 | 67.31,71.12 71.12,71.12 CP2.1 | IC8.1 57.15,69.85 58.42,68.58 63.5,68.58 66.04,71.12 67.31,71.12 | 67.31,71.12 CP1.2 | IC6.11 v69.85,53.34 | v123.62,36.83 D3.C | 99.62,12.83 100.69,11.76 103.89,11.76 107.09,8.56 107.09,8.38 107.44,8.03 108.69,8.03 116.86,16.21 116.86,18.52 117.75,19.41 121.49,19.41 123.09,17.8 IC1.11 | 99.62,12.83 94.82,17.63 94.11,17.63 IC2.11 | 67.44,12.83 62.99,12.83 62.28,13.54 62.28,13.89 48.59,27.58 48.23,27.58 44.5,31.32 44.5,31.67 C18.2 | C10.2 67.44,12.83 | 99.62,12.83 97.48,10.69 97.48,9.27 94.28,6.07 93.57,6.07 92.33,4.83 92.33,4.65 91.08,3.4 83.97,3.4 81.84,1.27 77.75,1.27 70.99,8.03 70.99,9.27 67.44,12.83
ADC_ECG
  Bottom 0.203: 107.97,53.36 100.33,53.36 IC7.8 | RA12.1 107.97,53.36 | ANALOG.2 119.89,26.16 123.62,26.16 124.33,26.87 124.33,37.01 107.97,53.36
ADC_ICG
  Bottom 0.203: IC7.1 85.22,45.72 87.53,43.41 92.51,43.41 96.42,39.5 97.66,39.5 RA4.1 101.57,35.59 115.44,35.59 123.09,27.94 ANALOG.4
ADC_PPG
  Bottom 0.203: RA16.1 95.35,63.5 85.22,53.36 IC7.14 85.04,53.19 84.15,52.3 84.15,44.65 93.57,35.23 108.33,35.23 108.86,34.7 108.86,34.52 115.44,27.94 ANALOG.1
ADC_RESP
  Top 0.203: 100.33,35.59 98.02,33.27 97.48,33.27 96.77,33.98 96.77,36.65 95.35,38.08 95.35,39.32 RA8.1 | IC7.7 100.33,35.59 | 100.33,35.59 103,32.92 115.62,32.92 120.6,27.94 ANALOG.3
ECG_E1
  Top 0.203: J8.1 77.39,15.32 77.39,8.92 RE1.1
ECG_E2
  Top 0.203: RE7.1 66.19,20.47 68.15,20.47 69.22,21.54 70.99,21.54 72.24,22.78 J8.3
ECG_E3
  Top 0.203: J8.5 72.41,25.27 72.41,24.56 73.66,23.32 73.66,22.43 72.77,21.54 71.88,21.54 71.17,20.83 71.17,11.23 76.68,5.71 76.68,5 78.28,3.4 90.73,3.4 91.44,2.69 RE17.2
  Bottom 0.203: RE17.2 91.44,2.69 92.86,2.69 93.57,3.4 103.35,3.4 104.06,2.69 RE16.2
ECG_OUT
  Top 0.203: 118.11,17.8 115.62,17.8 IC1.14 | 118.11,17.8 118.11,23.85 119.89,25.63 120.6,25.63 121.67,26.7 121.67,37.19 114.38,44.48 114.38,53.19 RA9.1 | 118.11,17.8 IC1.13
  Bottom 0.203: CE2.2 119.18,2.69 119.18,7.14 117.22,9.09 117.22,16.74 118.11,17.63 IC1.13
ELECTRODE3
  Top 0.203: RI18.2 RI19.1 48.26,29.17 CI7.1
GND  (via drill 0.33, 0.5)
  Top 0.203: RI1.1 RI34.1 55.88,13.97 55.88,17.78 53.34,20.32 RI17.1 | RI29.1 10.16,22.86 8.89,24.13 | RI24.1 16.51,20.32 11.43,20.32 RI29.1 | 10.2,21.55 RI29.1 | IC3.12 33.02,7.62 v36.83,11.43 C4.2 36.83,21.59 v34.29,24.13 | 6.31,66.04 C2.2 | RI26.1 16.51,58.46 CI13.2 11.43,53.38 RI33.1 10.16,49.53 10.16,46.99 8.89,45.72 T3.E | RI16.1 24.13,66.04 21.59,63.5 21.59,58.42 IC10.4 | v35.56,54.61 IC4.5 | C5.2 C1.2 | 59.69,52.07 CP5.1 59.69,53.34 | 59.69,52.07 62.23,49.53 62.23,44.45 CP4.1 | v52.07,49.53 RP14.1 | 59.69,52.07 v58.42,50.8 | C12.1 C15.1
  Bottom 0.203: v36.83,11.43 39.37,8.89 RI1.1 | RI26.1 19.05,66.04 22.86,66.04 24.13,67.31 RI16.1 31.75,68.58 C5.2 33.02,71.12 34.29,72.39 41.91,72.39 43.18,71.12 C15.1 43.18,68.58 44.45,67.31 50.8,67.31 52.07,66.04 CP8.2 58.42,66.04 59.69,67.31 RP12.2 | RI24.1 22.86,21.59 C11.1 25.4,21.59 35.56,21.59 C4.2 | v34.29,24.13 34.29,29.21 v35.56,30.48 | 5.12,24.13 2.58,21.59 CI9.2 | IC10.4 25.4,55.88 26.67,54.61 v35.56,54.61 57.15,54.61 58.42,53.34 59.69,53.34 CP5.1 | v52.07,49.53 53.34,50.8 v58.42,50.8
  Bottom 0.406: J1.7 J1.6 105.41,28.58
  other vias: 54.61,3.81 91.44,20.32 102.87,68.58 97.79,62.23 96.52,67.31
  pour Bottom: 0,81.28 0,0 138.43,0 138.43,81.28
  pour Top: 138.43,81.28 138.43,0 0,0 0,81.28
ICG_DEMUX  (via drill 0.33, 0.5)
  Top 0.203: RI31.1 v6.35,57.15 6.35,54.61 5.08,53.34 v5.08,45.72 5.03,45.72 5.03,42.52 1.29,38.79 1.29,23.85 5.03,20.12 5.03,19.05 RI23.1 | v20.32,57.15 v20.32,64.77
  Bottom 0.203: v5.08,45.72 8.89,45.72 10.16,44.45 RI12.2 | IC4.1 34.29,63.5 33.02,64.77 v20.32,64.77 | v6.35,57.15 v20.32,57.15
ICG_E1
  Top 0.203: CI1.1 63.52,6.43 63.52,7.67 64.41,8.56 64.41,11.76 63.35,12.83 62.99,12.83 56.06,19.76 56.06,22.61 60.15,26.7 70.99,26.7 72.24,27.94 J8.7
ICG_E2
  Bottom 0.203: CI2.1 63.52,14.07 65.3,14.07 71.17,19.94 71.17,20.83 71.88,21.54 72.77,21.54 73.66,22.43 73.66,29.19 72.41,30.43 J8.9
ICG_E3
  Top 0.203: CI7.2 53.39,29.36 66.9,29.36 69.22,31.67 70.99,31.67 72.24,32.92 J8.11
  Bottom 0.203: CI7.2 53.34,29.21
ICG_OUT  (via drill 0.33)
  Top 0.203: v30.28,29.72 33.12,29.72 35.08,31.67 35.61,31.67 38.1,34.16 IC5.1 38.1,34.34 39.17,35.41 54.1,35.41 59.08,40.39 63.35,40.39 64.41,41.45 64.41,42.34 64.06,42.7 64.06,59.94 64.24,60.12 64.24,64.21 66.9,66.88 66.9,68.48 74.55,76.12 77.93,76.12 84.15,69.9 91.44,69.9 RA1.1
  Bottom 0.203: 7.52,24.03 7.52,21.72 RI30.2 | 7.52,24.03 2.54,29.01 CI12.2 | v30.28,29.72 16.76,29.72 11.07,24.03 7.52,24.03
N$2
  Top 0.203: RE13.1 134.64,5.18 134.64,8.74 RE12.2 134.47,8.92 128.42,14.96 128.42,17.63 IC1.9
N$3
  Top 0.203: R2.1 128.25,69.72 128.25,67.41 R1.2
  Bottom 0.203: IC1.5 125.75,10.16 125.75,15.32 127,16.56 127,38.61 124.69,40.92 124.69,63.68 128.25,67.23 R1.2
N$6
  Bottom 0.203: C19.- 75.62,5.36 75.62,26.16 75.08,26.7 75.08,31.32 76.15,32.39 J6.6
N$7  (via drill 0.33)
  Top 0.203: v77.47,58.42 v77.47,49.53 | RP9.1 RP10.1
  Bottom 0.203: v77.47,49.53 RP10.1 | IC6.6 v77.47,58.42
N$9
  Top 0.203: RP11.1 74.93,63.5 IC6.7
  Bottom 0.203: RP10.2 77.47,59.69 76.2,60.96 IC6.7
N$10
  Top 0.203: D1.A 113.13,67.41 105.49,67.41 D2.C
N$11
  Top 0.203: RE11.2 112.95,22.78 112.95,18.87 110.64,16.56 CE1.2
  Bottom 0.203: IC1.10 125.58,17.8 125.04,17.8 121.31,21.54 114.38,21.54 113.13,22.78 RE11.2
N$12
  Top 0.203: IC1.12 120.6,17.8 120.6,24.03 CE3.1 120.78,24.03 123.27,24.03 124.33,22.96 133.22,22.96 RE15.2
N$13
  Top 0.203: RE14.1 122.02,5.18 124.33,5.18 RE13.2
  Bottom 0.203: IC1.8 130.73,17.63 130.73,14.61 126.64,10.52 126.64,7.32 124.51,5.18 RE13.2
N$14
  Top 0.203: RE14.2 111.89,5 114.2,2.69 CE2.1 114.38,2.69 115.09,2.69 121.67,9.27 121.67,18.16 123.09,19.58 123.09,22.78 RE15.1
N$15
  Bottom 0.203: RE17.1 81.3,2.69 81.3,3.76 82.19,4.65 82.19,7.85 81.66,8.38 81.66,13.01 86.28,17.63 IC2.14
N$16
  Bottom 0.203: IC2.5 95.88,10.16 91.8,6.07 86.11,6.07 81.66,1.63 77.93,1.63 74.02,5.54 74.02,30.61 72.95,31.67 67.26,31.67 66.19,30.61 RE7.2
N$21  (via drill 0.33)
  Top 0.203: RP11.2 66.04,62.23 64.77,60.96 v64.77,59.69
  Bottom 0.203: RP12.1 72.39,67.31 69.85,64.77 RP11.2 | v64.77,59.69 63.5,58.42 66.04,55.88 IC6.10
N$23
  Top 0.203: CI2.2 60.96,13.97 RI34.2
  Bottom 0.203: CI2.2 54.61,13.97 53.34,15.24 39.37,15.24 38.1,16.51 30.48,16.51 IC3.5
N$24  (via drill 0.5)
  Top 0.203: 17.74,16.47 CI3.1 17.78,16.51 19.05,15.24 v19.05,11.43
  Bottom 0.203: RI8.2 15.24,14.61 17.14,16.51 CI3.1 | v19.05,11.43 20.32,10.16 35.56,10.16 38.1,7.62 IC3.14
N$25
  Top 0.203: RI6.1 48.26,11.43 RI5.1
  Bottom 0.203: IC3.6 25.48,13.89 26.01,13.89 27.43,12.47 30.99,12.47 32.05,13.54 32.05,14.96 32.59,15.49 33.48,15.49 34.54,14.43 34.54,13.01 35.43,12.12 43.79,12.12 45.57,13.89 RI5.1
N$26
  Top 0.203: 93.93,4.12 93.93,5 RE5.2 | 93.93,4.12 93.93,2.69 RE16.1 | 93.93,4.12 87.17,4.12 82.55,8.74 RE3.1
  Bottom 0.203: RE3.1 82.55,11.41 88.77,17.63 IC2.13
N$27  (via drill 0.33, 0.5)
  Top 0.203: IC3.7 v22.86,16.51 | RI6.2 46.99,15.24 40.64,15.24 v39.37,16.51
  Bottom 0.203: IC3.7 20.32,13.97 17.78,11.43 12.7,11.43 RI7.1 | v39.37,16.51 38.1,17.78 29.21,17.78 27.94,16.51 v22.86,16.51
N$28
  Top 0.203: R2.2 118.11,69.72 117.22,68.83 117.22,66.88 118.11,65.99 R3.1 118.11,64.75 122.02,60.83 122.02,26.52 120.78,25.27 120.07,25.27 119.35,24.56 119.35,17.09 120.6,15.85 120.6,10.16 IC1.3
N$29
  Bottom 0.203: IC8.7 57.15,78.74 RP1.1
N$30
  Bottom 0.203: IC8.5 64.77,76.2 67.31,76.2 CP1.1
N$32
  Top 0.203: RI15.2 RI14.1 16.51,78.74 14.6,76.83 13.33,76.83 IC9.2 8.89,76.2 IC9.6
  Bottom 0.203: CI5.2 5.03,8.92 5.03,9.98 1.12,13.89 1.12,63.32 8.76,70.97 IC9.6
N$33
  Top 0.203: D4.C D3.A
N$34  (via drill 0.33)
  Top 0.203: v72.39,48.26 v72.39,36.83
  Bottom 0.203: v72.39,36.83 RP8.1 RP9.2 | IC6.2 v72.39,48.26
N$35  (via drill 0.5)
  Top 0.203: v34.29,62.23 34.29,46.99 33.02,45.72 v33.02,41.91
  Bottom 0.203: IC10.1 27.94,63.5 29.21,62.23 v34.29,62.23 | RI11.2 v33.02,41.91
N$36
  Top 0.203: IC9.7 13.33,73.03 17.14,73.03 RI15.1
N$37
  Top 0.203: IC10.3 24.23,58.52 24.23,60.83 IC10.2
  Bottom 0.203: IC4.2 36.68,61.01 34.54,63.14 34.01,63.14 32.77,64.39 23.16,64.39 22.63,63.86 22.63,62.43 24.05,61.01 IC10.2
N$38  (via drill 0.33)
  Top 0.203: v24.13,49.53 IC10.6 | v19.05,38.1 v19.05,50.8
  Bottom 0.203: v24.13,49.53 22.86,50.8 v19.05,50.8 | v19.05,38.1 21.59,38.1 22.86,39.37 RP18.1
N$39
  Bottom 0.203: 74.93,41.91 IC6.1 | RP6.1 74.93,41.91 | RP8.2 67.61,36.83 72.77,41.99 74.91,41.99 74.93,41.91
N$40
  Top 0.203: RI31.2 6.39,53.34 CI13.1
  Bottom 0.203: IC5.5 27.79,34.16 27.25,34.16 25.83,32.74 13.21,32.74 4.67,41.28 4.67,45.01 1.83,47.85 1.83,49.81 2.72,50.7 6.27,50.7 RI31.2
N$41  (via drill 0.33)
  Top 0.203: RP2.1 v48.26,71.12 | RP1.2 v50.8,76.2
  Bottom 0.203: IC8.2 57.15,71.12 v48.26,71.12 | v50.8,76.2 58.42,76.2 59.69,77.47 IC8.6 62.23,77.47 64.77,74.93 68.58,74.93 69.85,76.2 71.12,76.2 CP2.2 | RP1.2 RP2.1
N$42  (via drill 0.33)
  Top 0.203: v64.77,58.42 64.77,43.18 RP6.2 RP7.1
  Bottom 0.203: IC6.9 v64.77,58.42
N$47
  Top 0.203: 104.24,7.67 104.24,5.18 RE5.1 | 104.24,7.67 105.31,8.74 RE6.1 | IC2.6 99.62,10.16 102.11,7.67 104.24,7.67
N$48
  Top 0.203: RA1.2 101.57,69.72 101.57,68.66 100.15,67.23 100.15,59.59 99.08,58.52 CA1.1
  Bottom 0.203: IC7.3 90.73,45.72 92.33,44.12 95.53,44.12 | 95.53,44.12 97.66,41.99 RA2.2 | 95.53,44.12 96.42,45.01 96.42,49.1 96.77,49.45 96.77,56.21 98.91,58.34 CA1.1
N$51  (via drill 0.5)
  Top 0.203: v11.43,40.64 RI13.1 | T3.B v6.35,40.64
  Bottom 0.203: v6.35,40.64 v11.43,40.64
N$53  (via drill 0.33)
  Top 0.203: v62.23,55.88 v62.23,60.96 | v71.12,39.37 v71.12,60.96
  Bottom 0.203: v62.23,60.96 IC6.8 v71.12,60.96 | v62.23,55.88 59.69,55.88 CP6.1 | RP7.2 v71.12,39.37
N$54
  Top 0.203: RA3.2 85.22,41.99 85.22,43.41 87.53,45.72 IC7.2
  Bottom 0.203: RA4.2 107.8,39.5 98.91,39.5 94.64,43.76 89.66,43.76 87.71,45.72 IC7.2
N$55
  Top 0.203: 97.84,36.83 97.84,34.34 RA6.2 | IC7.5 95.88,45.72 97.48,47.32 98.2,47.32 98.73,46.79 98.73,37.72 97.84,36.83 | 97.84,36.83 RA5.2
  Bottom 0.203: CA2.1 101.57,63.32 101.57,62.61 96.24,57.28 96.24,49.45 95.35,48.56 95.35,45.72 IC7.5
N$56
  Top 0.203: RA7.2 85.04,36.83 85.04,39.32 RA8.2 85.22,39.5 90.91,39.5 97.13,45.72 IC7.6
N$57
  Top 0.203: RA10.2 110.64,43.23 114.2,43.23 RA9.2 | IC7.10 95.35,53.19 96.06,53.19 99.62,49.63 106.73,49.63 107.8,50.7 CA3.1
  Bottom 0.203: RA10.2 110.47,43.23 110.47,48.21 107.97,50.7 CA3.1
N$58
  Bottom 0.203: IC9.5 6.27,70.97 6.27,69.01 0.76,63.5 0.76,11.58 4.67,7.67 6.45,7.67 7.52,8.74 CI4.1
N$59
  Top 0.203: RA11.2 107.97,63.5 105.49,61.01 RA12.2
  Bottom 0.203: IC7.9 97.84,53.36 101.75,57.28 102.11,57.28 105.31,60.48 105.31,60.83 RA12.2
N$60
  Top 0.203: RA13.2 IC7.12 | RA14.2 95.35,60.83 95.35,58.52 RA13.2 | CA4.1 105.31,50.88 104.78,50.88 97.31,58.34 95.35,58.34 RA13.2
N$61
  Top 0.203: 87.71,63.5 RA16.2 | 87.71,63.5 91.44,67.23 RA15.2 | 87.71,63.5 87.71,53.36 IC7.13
N$62  (via drill 0.33)
  Top 0.203: v40.64,57.15 v40.64,49.53 v40.64,48.26 40.64,46.99 45.72,41.91 RP5.2 47.24,40.93 CP3.1
  Bottom 0.203: IC10.11 33.02,55.88 34.29,57.15 v40.64,57.15 | v40.64,49.53 34.29,49.53 33.02,48.26 IC10.8 | IC4.7 v40.64,48.26
N$63
  Bottom 0.203: CI6.2 13.93,73.7 IC9.3
N$64  (via drill 0.33)
  Top 0.203: IC4.10 RP13.2 | v57.15,53.34 57.15,57.15 58.42,58.42 58.42,60.96 59.69,60.96 CP6.2
  Bottom 0.203: IC4.10 v57.15,53.34
N$65  (via drill 0.33)
  Top 0.203: v20.32,45.72 20.32,55.88 v21.59,57.15
  Bottom 0.203: R4.2 35.56,44.45 34.29,45.72 v20.32,45.72 | v21.59,57.15 27.94,57.15 29.21,58.42 IC10.12
N$66
  Top 0.203: RP15.1 RP14.2 IC4.9 44.32,50.7 42.9,49.28 42.9,47.85 43.43,47.32 45.39,47.32 48.23,44.48 49.48,44.48 CP7.2
N$67
  Top 0.203: IC4.8 46.99,50.8 52.07,50.8 RP15.2 | RP15.2 RP16.1 | RP15.2 54.61,44.49 CP7.1
N$68
  Top 0.203: CP9.1 54.61,60.96 RP16.2 57.15,60.96 RP17.1
N$69
  Top 0.203: IC2.7 101.75,10.16 101.75,15.49 105.31,19.05 RE6.2 RE8.1
N$70
  Bottom 0.203: RE8.2 107.8,8.92 104.6,12.12 102.82,12.12 97.31,17.63 96.6,17.63 IC2.10 96.42,17.8 94.82,19.41 89.84,19.41 86.46,22.78 77.57,22.78 RE10.1
N$71
  Top 0.203: RE4.1 91.44,5.18 88.95,7.67 88.95,10.16 IC2.2 88.77,10.16 82.55,16.38 RE3.2
N$72
  Top 0.203: RE4.2 81.13,5.18 80.06,6.25 80.06,8.74 RE2.1 80.06,8.92 81.3,10.16 IC2.1
N$73
  Bottom 0.203: IC2.3 91.44,15.85 89.84,17.45 89.84,18.69 88.59,19.94 78.46,19.94 77.57,19.05 RE1.2
N$74
  Top 0.203: RI7.2 11.43,2.54 13.97,2.54 RI8.1 15.24,5.71 17.78,8.26 26.03,8.26 IC3.10
N$75
  Top 0.203: RE2.2 81.3,19.05 84.15,21.89 89.13,21.89 90.02,22.78 RE9.1 90.19,22.78 93.4,22.78 98.37,17.8 98.91,17.8 IC2.9
N$76
  Top 0.203: RI5.2 45.72,11.43 RI4.1
  Bottom 0.203: IC3.2 35.61,13.89 36.32,13.89 37.74,12.47 41.66,12.47 43.08,13.89 RI4.1
N$77
  Top 0.203: RE9.2 100.33,19.05 IC2.8
  Bottom 0.203: IC2.8 107.8,11.58 110.47,11.58 CE1.1
N$78  (via drill 0.5)
  Top 0.203: RI4.2 43.18,8.89 v41.91,10.16 IC3.1 | RI2.1 v50.8,10.16
  Bottom 0.203: v50.8,10.16 v41.91,10.16
N$79  (via drill 0.5)
  Top 0.203: RI1.2 60.96,6.35 CI1.2 52.07,6.35 v50.8,7.62
  Bottom 0.203: v50.8,7.62 39.37,7.62 IC3.3
N$80
  Top 0.203: RI3.1 22.86,3.81 IC3.9
  Bottom 0.203: RI2.2 50.8,5.71 49.53,6.99 41.27,6.99 38.73,4.45 27.3,4.45 IC3.9
N$81
  Top 0.203: IC4.12 RP17.2 49.66,63.5 49.66,65.99 CP8.1
N$84
  Top 0.203: RI9.2 12.85,3.94 17.65,8.74 17.65,13.89 RI3.2 17.65,14.07 17.65,14.96 16.59,16.03 16.59,16.92 17.3,17.63 18.19,17.63 18.72,17.09 19.43,17.09 22.99,20.65 22.99,21.36 25.3,23.67 26.9,23.67 29.57,26.34 29.57,31.5 32.05,33.98 32.05,35.23 32.59,35.76 33.48,35.76 34.54,34.7 34.54,33.45 35.25,32.74 35.97,32.74 36.5,33.27 36.5,41.1 34.37,43.23 34.37,44.3 RI10.1
  Bottom 0.203: IC3.8 19.05,2.54 13.97,2.54 RI9.2 | RI10.1 31.75,44.45 29.21,41.91 RI11.1
N$95
  Top 0.203: RI20.2 RI21.1 39.37,30.48 36.83,30.48 35.56,29.21 IC5.13
N$96  (via drill 0.5)
  Top 0.203: RI24.2 17.78,22.86 19.05,21.59 | v19.05,17.78 19.05,21.59 | IC5.10 27.94,25.4 26.67,24.13 21.59,24.13 19.05,21.59
  Bottom 0.203: v19.05,17.78 11.43,17.78 11.43,16.51 CI8.2
N$100
  Top 0.203: RI17.2 RI18.1 43.18,24.13 35.56,24.13 IC5.12
N$101  (via drill 0.5)
  Top 0.203: CI3.2 12.7,16.47 RI9.1 12.7,12.07 v15.24,9.53
  Bottom 0.203: v15.24,9.53 32.38,9.53 IC3.13
N$102  (via drill 0.5)
  Top 0.203: v26.67,44.45 v26.67,59.69 | RI12.1 RI10.2
  Bottom 0.203: IC4.3 34.29,58.42 33.02,59.69 v26.67,59.69 | RI10.2 v26.67,44.45
N$103
  Top 0.203: CI10.1 17.78,34.29 IC5.9 | RI26.2 RI25.1
  Bottom 0.203: 13.97,34.29 CI10.1 14.1,34.34 14.1,40.92 22.28,49.1 22.28,49.81 21.74,50.34 21.39,50.34 21.21,50.16 18.72,50.16 18.36,50.52 18.36,51.05 18.9,51.59 18.9,53.19 RI25.1
N$105  (via drill 0.33)
  Top 0.203: RI33.2 RI32.1 | v9.12,35.94 23.16,35.94 24.76,34.34 25.3,34.34 IC5.6
  Bottom 0.203: v9.12,35.94 1.47,43.59 1.47,53.54 RI32.1
N$106
  Top 0.203: RI27.2 RI28.1 12.7,22.86 10.16,25.4 3.77,25.4 CI12.1
N$107  (via drill 0.5)
  Top 0.203: 11.07,34.29 12.06,34.29 14.6,31.75 RI27.1 v15.24,26.67 | 11.07,34.29 CI10.2 | 11.07,34.29 11.07,31.32 10.54,30.79 7.34,30.79 5.92,32.21 5.92,34.52 8.58,37.19 8.94,37.19 12.32,40.56 12.32,45.01 19.96,52.65 19.96,53.72 19.07,54.61 19.07,63.5 RI25.2 | 11.07,34.34 11.07,34.29
  Bottom 0.203: v15.24,26.67 IC5.8
N$108  (via drill 0.33)
  Top 0.203: IC5.3 v33.02,30.48 | RI28.2 v12.7,26.67
  Bottom 0.203: RI28.2 13.97,30.48 v33.02,30.48 | v12.7,26.67 7.62,26.67 5.08,29.21 CI11.1
N$109
  Top 0.203: RI29.2 RI30.1 6.35,33.02 6.35,34.29 8.89,36.83 34.29,36.83 35.56,35.56 IC5.2
N$110
  Top 0.203: RI23.2 15.2,19.01 7.62,19.01 CI8.1 7.58,14.05 CI9.1
N$10000
  Top 0.203: IC8.3 60.96,63.5 63.5,60.96 RP4.1
PPG_DP  (via drill 0.33)
  Top 0.203: v39.37,50.8 39.37,38.1 CP3.2 37.08,40.43 RP5.1
  Bottom 0.203: v39.37,50.8 IC4.6 | J8.6 69.75,25.45 68.5,25.45 53.03,40.92 38.1,40.92 37.21,41.81 RP5.1
PPG_IAN  (via drill 0.33)
  Top 0.203: v59.69,50.8 CP5.2 59.69,48.26
  Bottom 0.203: 58.42,52.07 v59.69,50.8 | 58.42,52.07 34.29,52.07 33.02,53.34 IC10.10 | 58.42,52.07 69.85,52.07 73.66,55.88 IC6.5
PPG_IAP  (via drill 0.33)
  Top 0.203: v58.42,49.53 58.42,48.26 57.15,46.99 57.15,44.45 CP4.2
  Bottom 0.203: IC6.3 69.85,50.8 68.58,49.53 v58.42,49.53 | IC10.9 31.7,50.7 31.7,50.16 30.28,48.74 30.28,47.85 31.7,46.43 55.17,46.43 57.12,44.48 CP4.2
PPG_LEDN
  Top 0.203: R4.1 49.53,41.91 T4.C
  Bottom 0.203: J8.4 69.75,22.96 69.39,22.96 53.92,38.43 50.55,38.43 49.66,39.32 T4.C
PPG_LEDP
  Bottom 0.203: RP3.1 63.52,39.32 63.52,31.67 68.5,26.7 70.28,26.7 71.17,25.81 71.17,21.72 69.93,20.47 J8.2
PPG_OUT
  Top 0.203: IC4.14 IC4.13
  Bottom 0.203: IC4.13 CP9.2 49.66,60.83 50.72,59.77 60.15,59.77 60.68,60.3 65.13,60.3 65.48,59.94 75.26,59.94 75.97,59.23 77.57,59.23 78.28,58.52 85.04,58.52 RA13.1
RESET
  Top 0.203: C19.+ 77.75,5.36 77.75,7.85 78.99,9.09 78.99,19.41 85.75,26.16 95.88,26.16 97.66,27.94 J1.3
RESP_OUT  (via drill 0.33)
  Top 0.203: v104.6,33.63 107.8,36.83 RA5.1 | v29.92,47.14 v31.88,47.14
  Bottom 0.203: 28.68,48.03 26.72,46.08 21.21,46.08 20.85,46.43 20.14,46.43 18.36,44.65 18.36,37.9 21.92,34.34 22.81,34.34 IC5.7 | 28.68,48.03 28.68,48.56 24.76,52.48 21.21,52.48 19.43,54.25 12.32,54.25 8.94,50.88 RI32.2 | v104.6,33.63 98.37,33.63 95.35,30.61 78.28,30.61 77.22,31.67 77.22,33.81 75.08,35.94 65.66,35.94 64.41,37.19 64.41,39.85 63.35,40.92 62.28,40.92 56.06,47.14 v31.88,47.14 | v29.92,47.14 29.57,47.14 28.68,48.03
RI13  (via drill 0.5)
  Top 0.203: RI22.1 v21.59,49.53 21.74,49.63 21.74,50.34 24.05,52.65 24.05,53.19 IC10.5 | v2.54,49.53 2.54,45.72 3.81,44.45 T3.C
  Bottom 0.203: v2.54,49.53 v21.59,49.53
RX
  Top 0.203: DIGITAL1.1 128.25,76.12 127.89,76.12 122.91,71.14 94.11,71.14 91.26,68.3 88.59,68.3 81.3,61.01 81.3,32.56 J6.4 81.3,32.39 81.3,27.94 J7.4
TX
  Top 0.203: J7.5 78.82,27.94 78.82,32.39 J6.5
  Bottom 0.203: DIGITAL1.2 125.58,76.12 125.22,76.12 119.89,70.79 110.82,70.79 104.6,64.57 94.46,64.57 80.95,51.05 80.95,34.7 78.82,32.56 J6.5
V+  (via drill 0.5)
  Top 0.203: RI19.2 46.99,17.78 44.45,17.78 RI21.2 v43.18,22.86
  Bottom 0.203: v43.18,22.86 39.37,26.67 IC5.14
VCC_5V
  Top 0.203: J1.5 102.46,27.94 100.69,29.72 88.24,29.72 87.35,28.83 | 87.35,28.83 86.46,27.94 J7.2 | IC7.4 92.15,45.72 86.82,40.39 84.86,40.39 83.97,39.5 83.97,32.56 J6.3 83.79,32.39 87.35,28.83

### Text on the board
tPlace: 13 | 12 | 11 | 10 | 9 | 8 | 7 | 6 | 5 | 4 | 3 | 2 | 1 | 0 | EE122B Bioshield v1
bPlace: EE122B Bioshield v1
tNames: DIGITAL | AREF | SCL | SDA | GND | IOREF | RES | 3V3 | 5V | GND | GND | 9V | A0 | A1 | A2 | A3 | A4 | A5